# Altium project S7CAS-PLEIADES-CARTE-MERE_Pxx.PrjPcb (part 2 of 3)

## Sheet S7CAS-PLEIADES-CARTE-MERE_Pxx_FLASH_PHY_CLOCK.SchDoc
size Tabloid; SheetNumber: 10; SheetTotal: 18; Sheet_Name: FLASH CLOCK; Size: 11x17
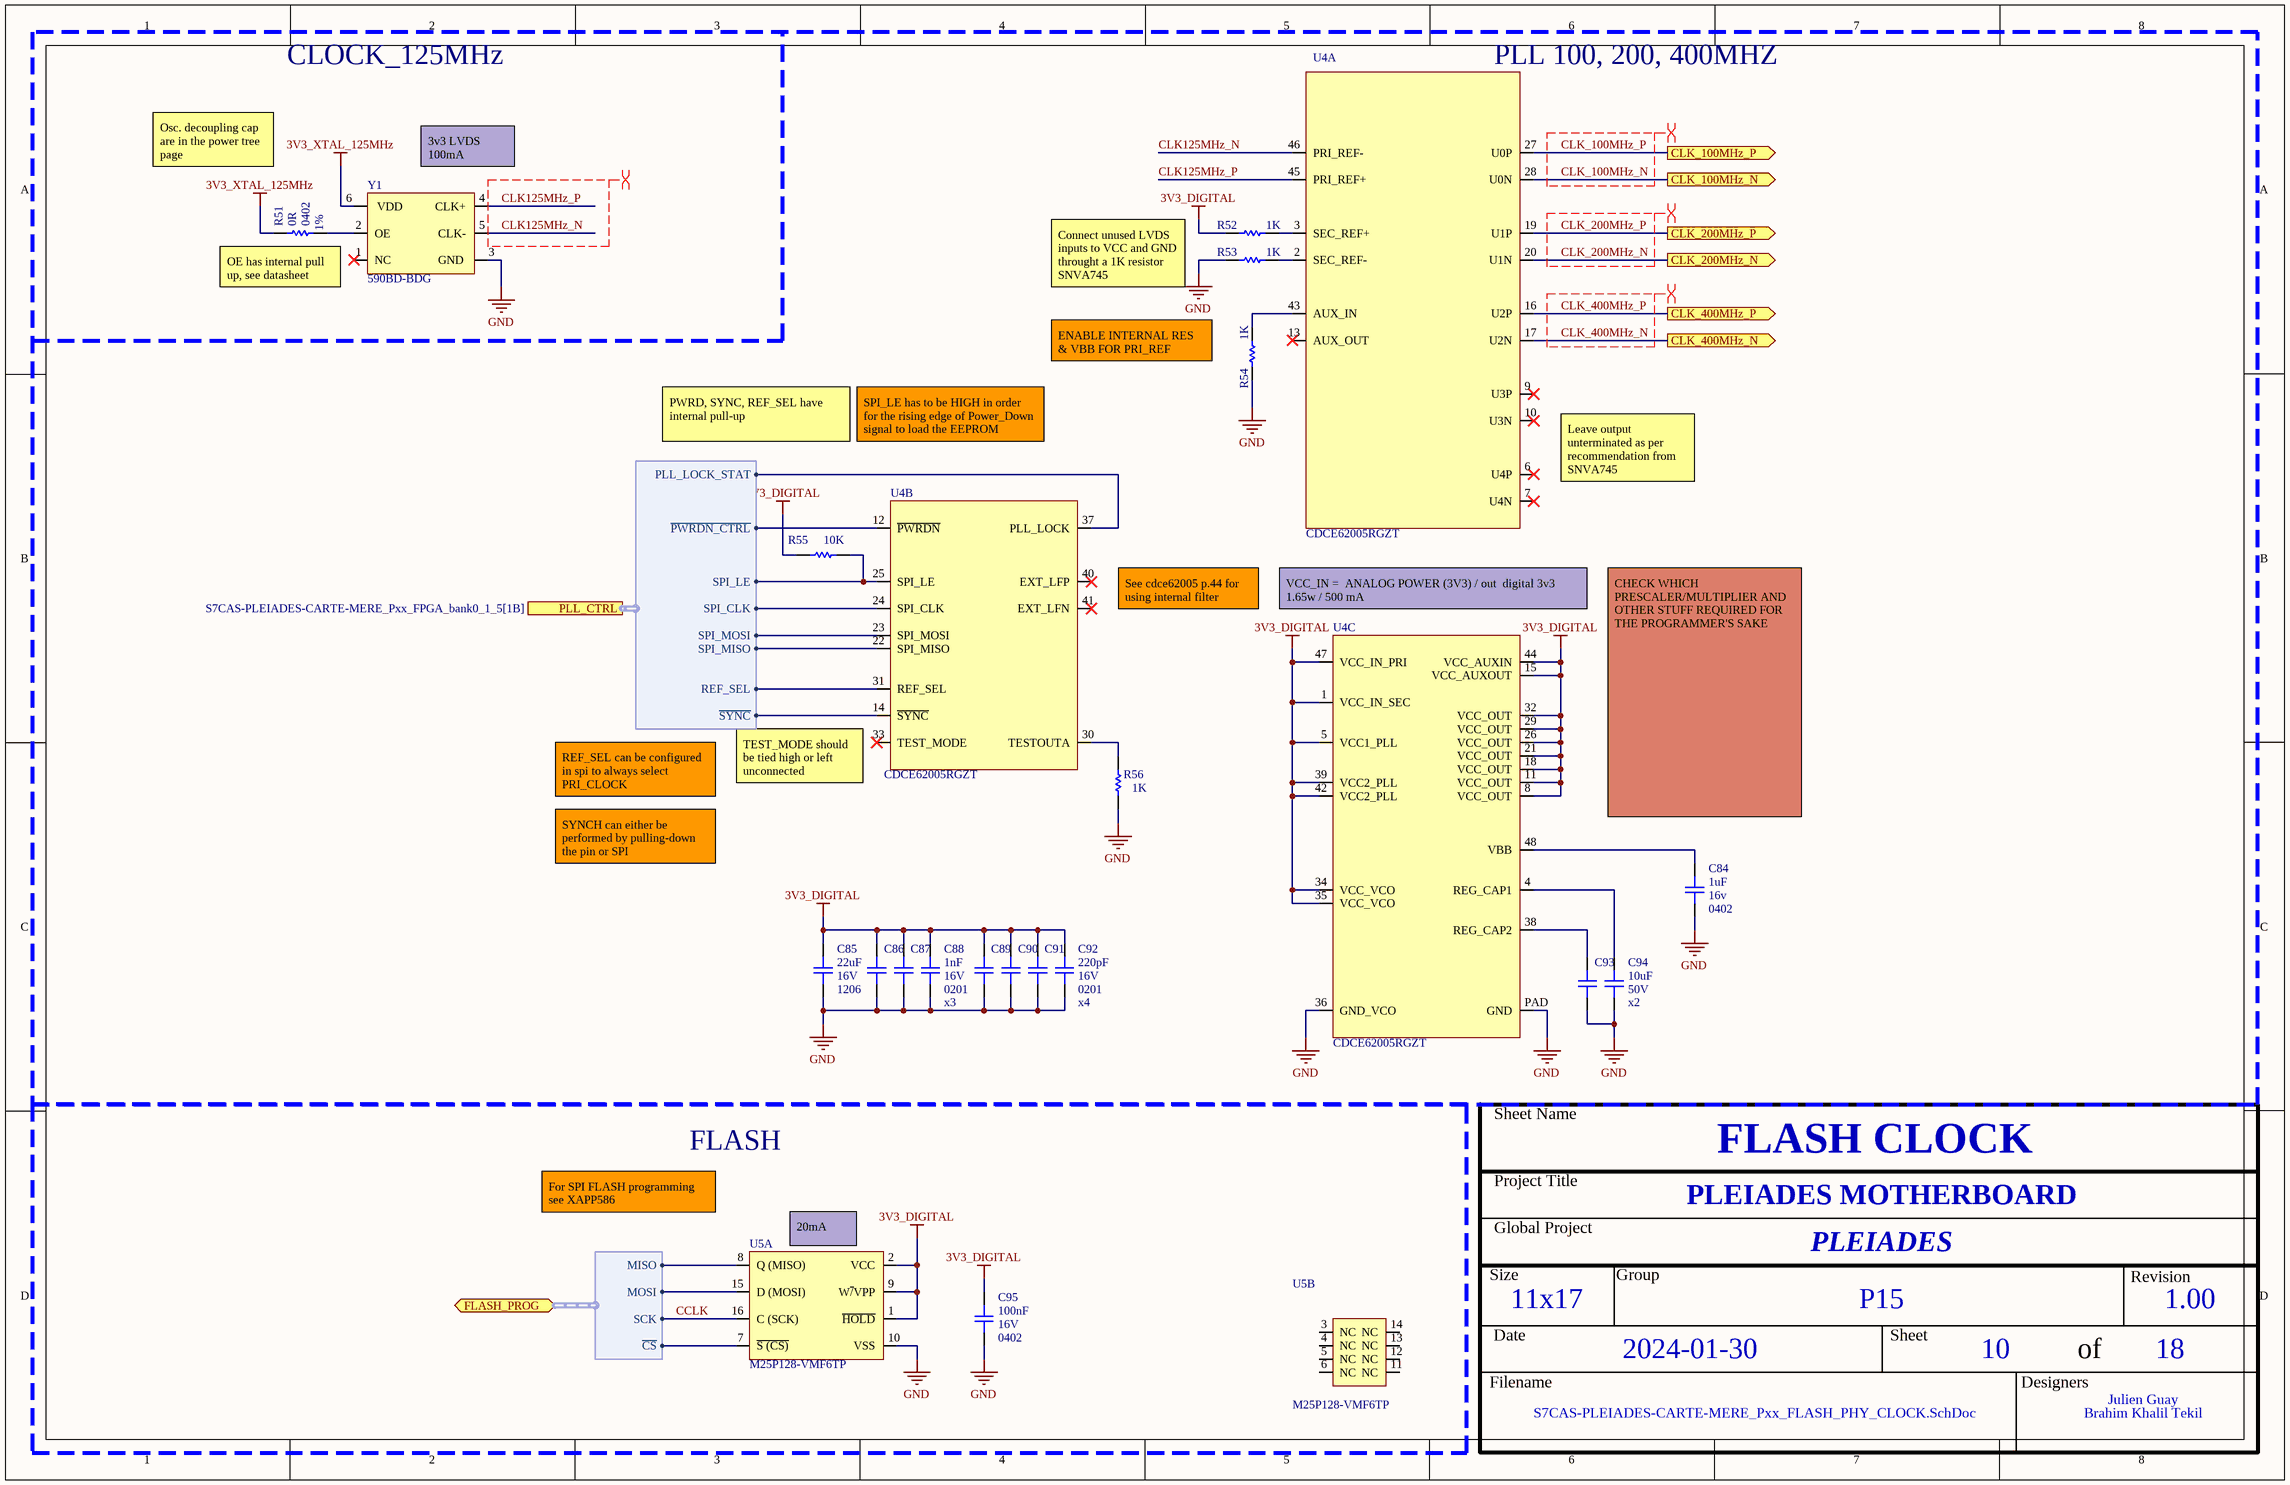
[diagram p7: S7CAS-PLEIADES-CARTE-MERE_Pxx_FLASH_PHY_CLOCK.SchDoc]

### Parts
C84  value 1uF  Voltage: 16v  [CAP_0402]  (hidden comment: 0402)
C85  value 22uF  Voltage: 16V  Package: 1206  [CAP_1206]  (hidden comment: CAP - 1206)
C86  CAP - 0201  [CAP_0201]  (value not drawn)
C87  CAP - 0201  [CAP_0201]  (value not drawn)
C88  value 1nF  Voltage: 16V  Package: 0201  [CAP_0201]  (hidden comment: CAP - 0201)
C89  CAP - 0201  [CAP_0201]  (value not drawn)
C90  CAP - 0201  [CAP_0201]  (value not drawn)
C91  CAP - 0201  [CAP_0201]  (value not drawn)
C92  value 220pF  Voltage: 16V  Package: 0201  [CAP_0201]  (hidden comment: CAP - 0201)
C93  CAP - 1206  [CAP_1206]  (value not drawn)
C94  value 10uF  Voltage: 50V  [CAP_1206]  (hidden comment: CAP - 1206)
C95  value 100nF  Voltage: 16V  [CAP_0402]  (hidden comment: 0402)
R51  value 0R  Package: 0402  Precision: 1%  [RES_0402]  (hidden comment: RES - 0603)
R52  value 1K  [RES_0402]  (hidden comment: RES - 0603)
R53  value 1K  [RES_0402]  (hidden comment: RES - 0603)
R54  value 1K  [RES_0402]  (hidden comment: RES - 0603)
R55  value 10K  [RES_0402]  (hidden comment: RES - 0603)
R56  value 1K  [RES_0402]  (hidden comment: RES - 0603)
U4  CDCE62005RGZT  [TIM_CDCE62005RGZT]  (parts A,B,C of 3)
U5  M25P128-VMF6TP  [FLASH - M25P128-VMF6TP]  (parts A,B of 2)
Y1  590BD-BDG  [OSC_590BD-BDG]

### Blocks framed on the sheet
FLASH: C95 U5

### Ports
CLK_100MHz_N (out, see S7CAS-PLEIADES-CARTE-MERE_Pxx_FPGA_bank0_1_5[4A]), CLK_100MHz_P (out, see S7CAS-PLEIADES-CARTE-MERE_Pxx_FPGA_bank0_1_5[4A]), CLK_200MHz_N (out, see S7CAS-PLEIADES-CARTE-MERE_Pxx_CAN[1C]), CLK_200MHz_P (out, see S7CAS-PLEIADES-CARTE-MERE_Pxx_CAN[1C]), CLK_400MHz_N (out, see S7CAS-PLEIADES-CARTE-MERE_Pxx_CNA[2C]), CLK_400MHz_P (out, see S7CAS-PLEIADES-CARTE-MERE_Pxx_CNA[2C]), FLASH_PROG (bidir, harness FLASH_PROG, see S7CAS-PLEIADES-CARTE-MERE_Pxx_FPGA_bank2_4[2D]), PLL_CTRL (harness PLL_CTRL, see S7CAS-PLEIADES-CARTE-MERE_Pxx_FPGA_bank0_1_5[1B])

### Harnesses
PLL_CTRL: ~{PWRDN_CTRL}, SPI_LE, SPI_CLK, SPI_MOSI, SPI_MISO, REF_SEL, ~{SYNC}, PLL_LOCK_STAT
FLASH_PROG: MISO, MOSI, SCK, ~{CS}

### Nets
3V3_DIGITAL: C85.2 C86.2 C87.2 C88.2 C89.2 C90.2 C91.2 C92.2 C95.2 R52.2 R55.2 U4.1(VCC_IN_SEC) U4.5(VCC1_PLL) U4.8(VCC_OUT) U4.11(VCC_OUT) U4.15(VCC_AUXOUT) U4.18(VCC_OUT) U4.21(VCC_OUT) U4.26(VCC_OUT) U4.29(VCC_OUT) U4.32(VCC_OUT) U4.34(VCC_VCO) U4.35(VCC_VCO) U4.39(VCC2_PLL) U4.42(VCC2_PLL) U4.44(VCC_AUXIN) U4.47(VCC_IN_PRI) U5.1(~{HOLD}) U5.2(VCC) U5.9(W~{/}VPP)
3V3_XTAL_125MHz: R51.2 Y1.6(VDD)
GND: C84.1 C85.1 C86.1 C87.1 C88.1 C89.1 C90.1 C91.1 C92.1 C93.1 C94.1 C95.1 R53.2 R54.2 R56.1 U4.36(GND_VCO) U4.PAD(GND) U5.10(VSS) Y1.3(GND)
~{PLL_PWRD_CTRL}: U4.12(~{PWRDN}) ; port PLL_CTRL.~{PWRDN_CTRL}
~{PLL_SYNC}: U4.14(~{SYNC}) ; port PLL_CTRL.~{SYNC}
CCLK: U5.16(C_(SCK)) ; port FLASH_PROG.SCK
CLK125MHz_N: U4.46(PRI_REF-) Y1.5(CLK-)
CLK125MHz_P: U4.45(PRI_REF+) Y1.4(CLK+)
CLK_100MHz_N: U4.28(U0N) ; port CLK_100MHz_N
CLK_100MHz_P: U4.27(U0P) ; port CLK_100MHz_P
CLK_200MHz_N: U4.20(U1N) ; port CLK_200MHz_N
CLK_200MHz_P: U4.19(U1P) ; port CLK_200MHz_P
CLK_400MHz_N: U4.17(U2N) ; port CLK_400MHz_N
CLK_400MHz_P: U4.16(U2P) ; port CLK_400MHz_P
PLL_CLK: U4.24(SPI_CLK) ; port PLL_CTRL.SPI_CLK
PLL_LE: R55.1 U4.25(SPI_LE) ; port PLL_CTRL.SPI_LE
PLL_LOCK_STAT: U4.37(PLL_LOCK) ; port PLL_CTRL.PLL_LOCK_STAT
PLL_MISO: U4.22(SPI_MISO) ; port PLL_CTRL.SPI_MISO
PLL_MOSI: U4.23(SPI_MOSI) ; port PLL_CTRL.SPI_MOSI
PLL_REF_SEL: U4.31(REF_SEL) ; port PLL_CTRL.REF_SEL
NetC84_2: C84.2 U4.48(VBB)
NetC93_2: C93.2 U4.38(REG_CAP2)
NetC94_2: C94.2 U4.4(REG_CAP1)
NetR51_1: R51.1 Y1.2(OE)
NetR52_1: R52.1 U4.3(SEC_REF+)
NetR53_1: R53.1 U4.2(SEC_REF-)
NetR54_1: R54.1 U4.43(AUX_IN)
NetR56_2: R56.2 U4.30(TESTOUTA)
NetU5_7: U5.7(~{S_(CS)}) ; port FLASH_PROG.~{CS}
NetU5_8: U5.8(Q_(MISO)) ; port FLASH_PROG.MISO
NetU5_15: U5.15(D_(MOSI)) ; port FLASH_PROG.MOSI

Not connected (* = marked no-connect by the designer): U4 6(U4P)* 7(U4N)* 9(U3P)* 10(U3N)* 13(AUX_OUT)* 33(TEST_MODE)* 40(EXT_LFP)* 41(EXT_LFN)*; U5 3(NC) 4(NC) 5(NC) 6(NC) 11(NC) 12(NC) 13(NC) 14(NC); Y1 1(NC)*

### Layout directives
differential pair; differential pair class XTAL_CLK_125MHz; differential pair class LVDS: CLK125MHz_N, CLK125MHz_P
differential pair; differential pair class CLK_100MHz; differential pair class LVDS: CLK_100MHz_N, CLK_100MHz_P
differential pair; differential pair class CLK_200MHz; differential pair class LVDS: CLK_200MHz_N, CLK_200MHz_P
differential pair; differential pair class CLK_400MHz; differential pair class LVDS: CLK_400MHz_N, CLK_400MHz_P

### Notes on the sheet
- CLOCK_125MHz
- PLL 100, 200, 400MHZ
- Osc. decoupling cap are in the power tree page
- (near Y1) 3v3 LVDS 100mA
- (near R51) OE has internal pull up, see datasheet
- Connect unused LVDS inputs to VCC and GND throught a 1K resistor
  SNVA745
- (near R54) ENABLE INTERNAL RES & VBB FOR PRI_REF
- PWRD, SYNC, REF_SEL have internal pull-up
- SPI_LE has to be HIGH in order for the rising edge of Power_Down signal to load the EEPROM
- (near U4) Leave output unterminated as per recommendation from SNVA745
- (near U4) See cdce62005 p.44 for using internal filter
- VCC_IN =  ANALOG POWER (3V3) / out  digital 3v3
  1.65w / 500 mA
- REF_SEL can be configured in spi to always select PRI_CLOCK
- (near U4) TEST_MODE should be tied high or left unconnected
- CHECK WHICH PRESCALER/MULTIPLIER AND OTHER STUFF REQUIRED FOR THE PROGRAMMER'S SAKE
- SYNCH can either be performed by pulling-down the pin or SPI
- x3
- (near C92) x4
- (near C94) x2
- For SPI FLASH programming see XAPP586
- (near U5) 20mA
- Sheet Name
- Project Title
- Global Project
- Size
- Group
- Revision
- Date
- Sheet
- of
- Filename
- Designers

### Library data of the parts
C84 C95 = CAP - 0603: CAP - 0402; Precision: 10%; Current: *; CreatedBy: Jonathan Bouchard; Power: *; Package: 0402; Supplier 1: Arrow Electronics
  C84: Supplier Part Number 1: CL10B105MO8NNWC
  C95: Supplier Part Number 1: CL10B104KO8NNNC
C85 C94 = CAP - 1206: Precision: 10%; Current: *; CreatedBy: Jonathan Bouchard; Power: *
  C85: Supplier 1: Arrow Electronics; Supplier Part Number 1: CL31A226MOCLNNC
  C94: Package: 1206; Supplier 1: Avnet; Supplier Part Number 1: CL31A106MBHNNNE
C86 C87 = CAP - 0201: Precision: 10%; Voltage: 16V; Value: 1nF; Current: *; CreatedBy: Jonathan Bouchard; Power: *; Package: 0201; Supplier 1: Avnet; Supplier Part Number 1: GRM033R71C102KA01J
C88 C92 = CAP - 0201: Precision: 10%; Current: *; CreatedBy: Jonathan Bouchard; Power: *
  C88: Supplier 1: Avnet; Supplier Part Number 1: GRM033R71C102KA01J
  C92: Supplier 1: Arrow Electronics; Supplier Part Number 1: GRM033R71C221KA01D
C89-C91 = CAP - 0201: Precision: 10%; Voltage: 16V; Value: 220pF; Current: *; CreatedBy: Jonathan Bouchard; Power: *; Package: 0201; Supplier 1: Arrow Electronics; Supplier Part Number 1: GRM033R71C221KA01D
C93 = CAP - 1206: Precision: 10%; Voltage: 50V; Value: 10uF; Current: *; CreatedBy: Jonathan Bouchard; Power: *; Package: 1206; Supplier 1: Avnet; Supplier Part Number 1: CL31A106MBHNNNE
R51 = RES - 0603: RES - 0402; Current: *; CreatedBy: Jonathan Bouchard; Supplier 1: Arrow Electronics; Supplier Part Number 1: RMCF0603ZT0R00
R52-R56 = RES - 0603: RES - 0402; Precision: 1%; Current: *; CreatedBy: Jonathan Bouchard; Package: 0402
  R52-R54: Supplier 1: Mouser; Supplier Part Number 1: 71-CRCW0603-10K-E3
  R55: Supplier 1: Arrow Electronics; Supplier Part Number 1: RMCF0603FT10K0
  R56: Supplier 1: Arrow Electronics; Supplier Part Number 1: RMCF0603FT1K00
U4 = TIM_CDCE62005RGZT: TIM - CLK SYNTH JITTER CLEANER 3:5 - QFN-48; Voltage: 3 V ~ 3.6 V; Mfg: Texas Instruments; Current: *; Power: *; Mfg Part Number: CDCE62005RGZT; HelpURL: http://www.ti.com/lit/ds/symlink/cdce62005.pdf; CreatedBy: Jonathan Bouchard; Temperature: -40°C ~ 85°C; Value: *; Precision: *; Package: QFN-48; Supplier 1: Digikey; Supplier Part Number 1: 296-23947-1-ND
U5 = FLASH  - M25P128-VMF6TP: 128-Mbit, low-voltage, serial flash memory / with 54-MHz SPI bus interface; GRAMS Lib Spec: 2.7; Supplier 1: Digikey; Supplier Part Number 1: M25P128-VMF6TP CT-ND
Y1 = OSC_590BD-BDG: TIM - OSC PROG 125MHz ~ 214.999MHz LVDS 3.3V 7PPM EN/DS - 6-SMD; Manufacturer #1: Silicon Labs; Current Rating: 100 mA (supply); Note: Spécifié la fréquence lors de la commande; Voltage rating: 3.3V (supply); Polarized: Yes; Value: ±7ppm (freq Stability), ±20ppm (freq stability total); Magnetic Material: UNKNOWN; GRAMS Lib Spec: 2.8; Manufacturer #2: *; Power Max: *; Part Number #1: 590BD-BDG; Part Number #2: *; HelpURL: https://www.silabs.com/documents/public/data-sheets/Si590-591.pdf; Supplier 1: Digi-Key; Supplier Part Number 1: 590BD-BDG-ND; Assembly Type: SMD; Temperature: -40°C ~ 85°C; Package: 6-SMD; CreatedBy/Date: from 590BD-CDG; Tolerance: *; VerifiedBy: Caroline Paulin / 3/10/2019; Cryo: UNKNOWN

## Sheet S7CAS-PLEIADES-CARTE-MERE_Pxx_CAN.SchDoc
size Tabloid; SheetNumber: 12; SheetTotal: 18; Sheet_Name: CAN; Size: 11x17
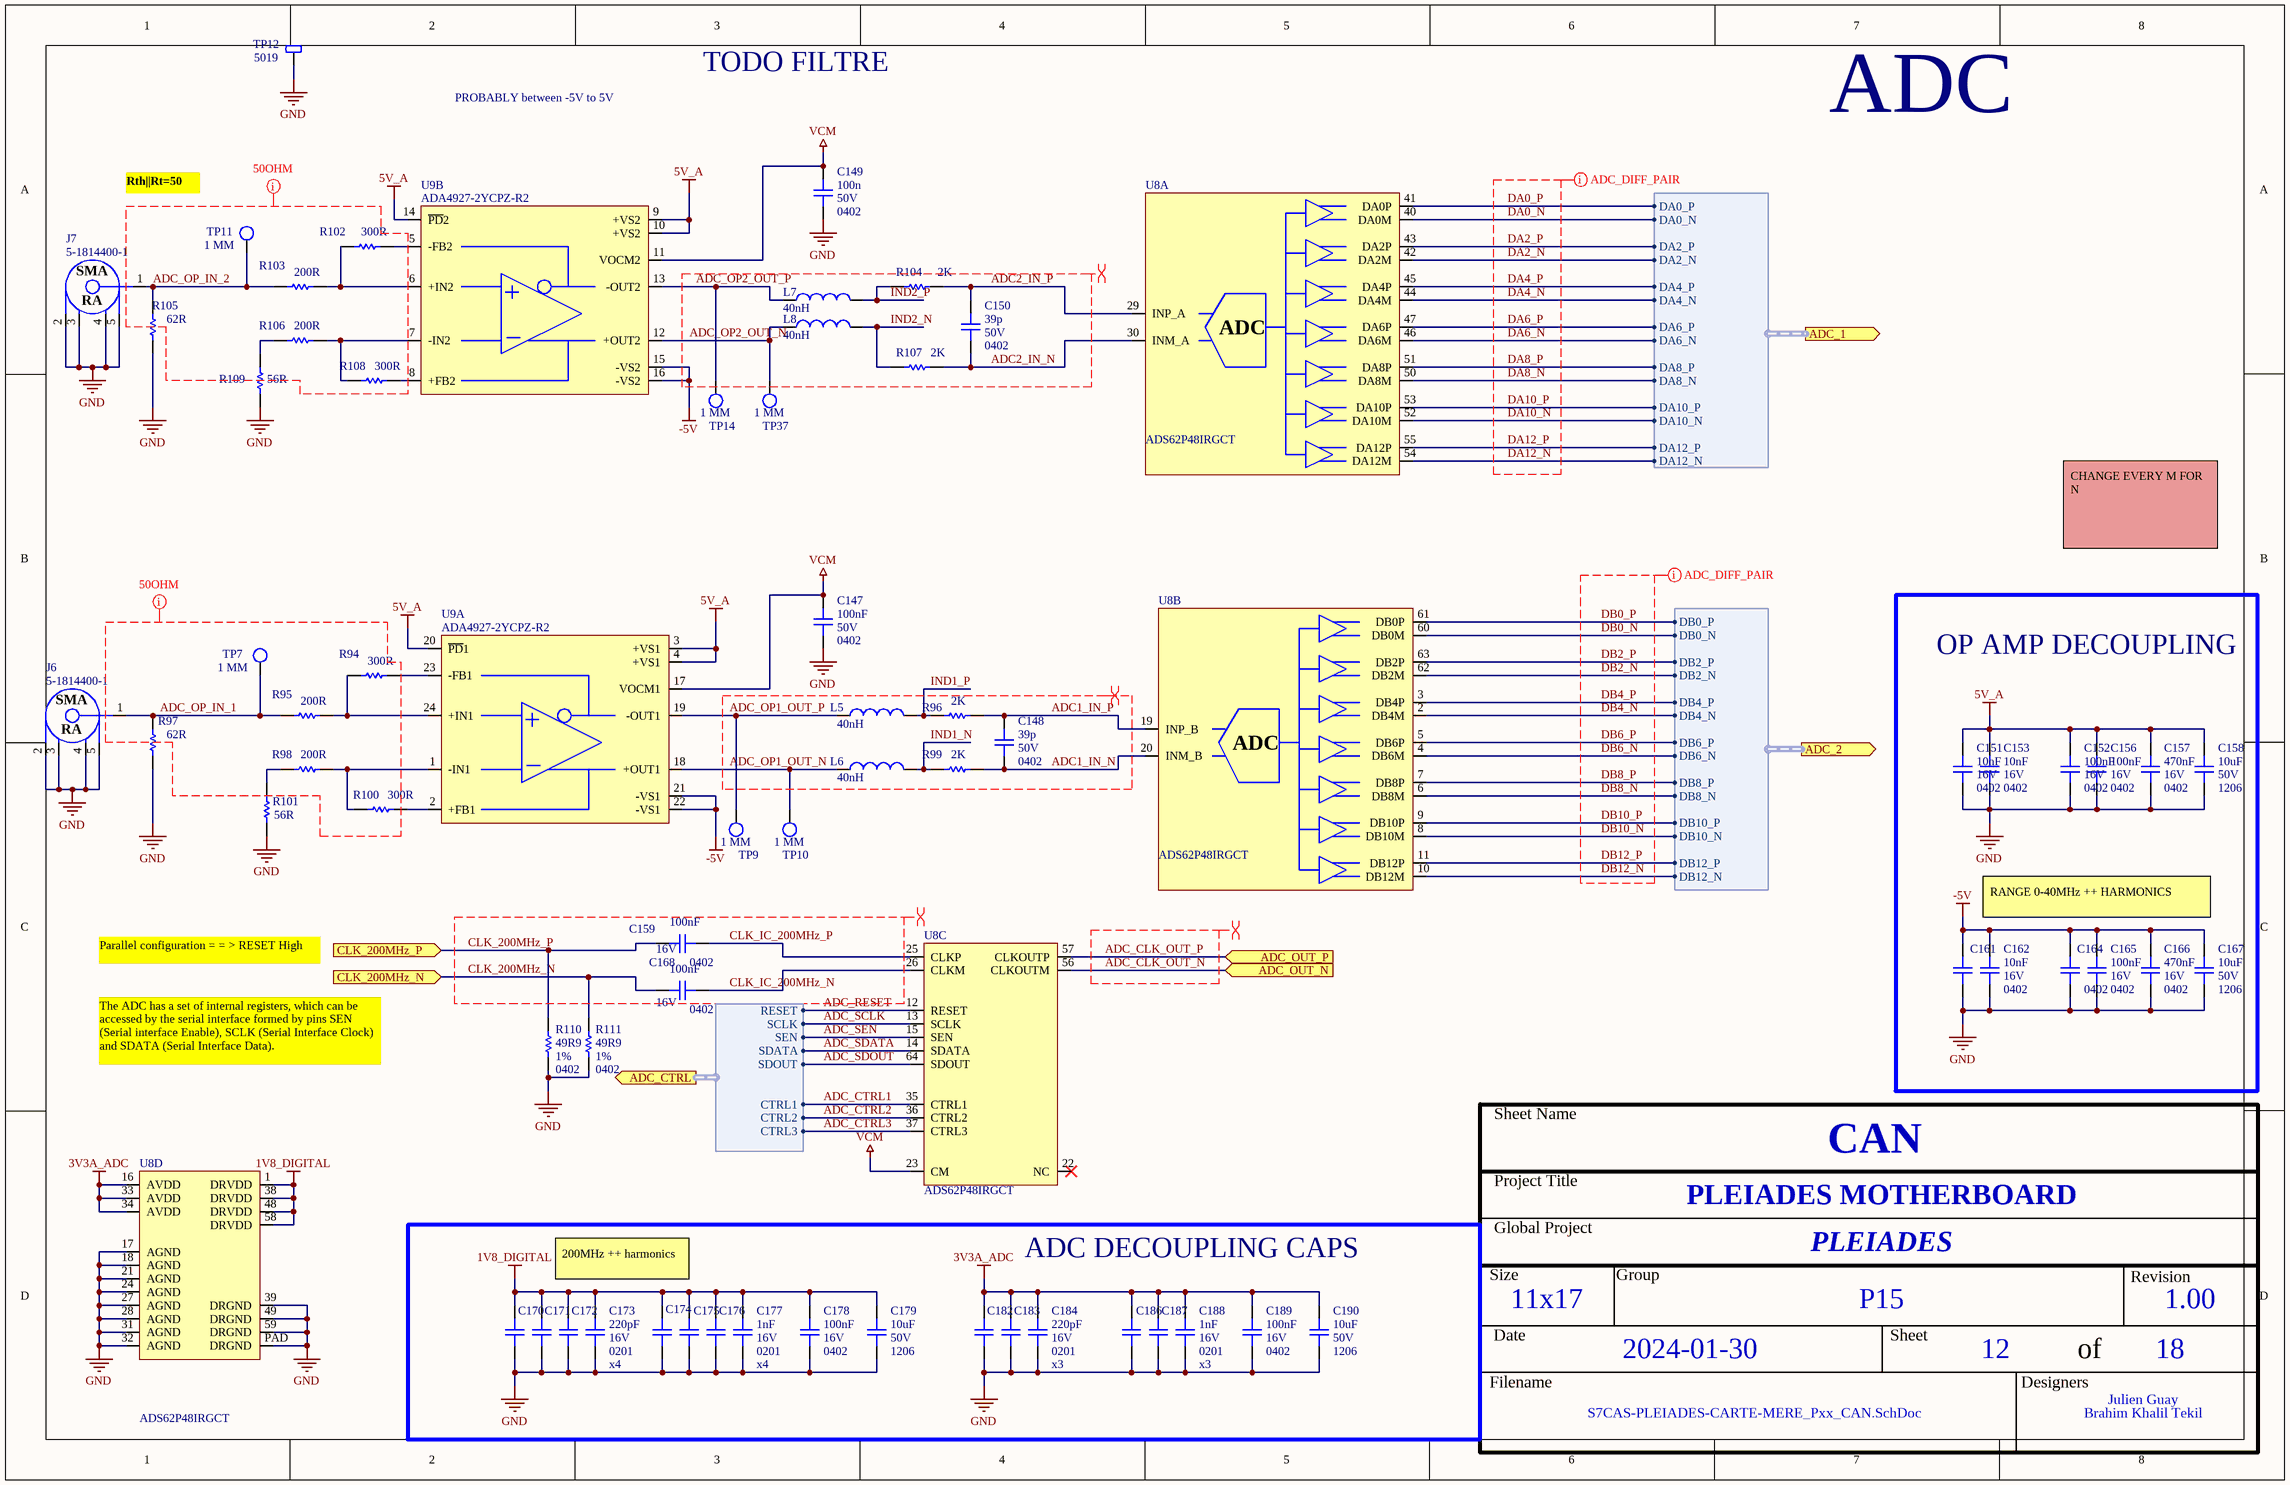
[diagram p8: S7CAS-PLEIADES-CARTE-MERE_Pxx_CAN.SchDoc]

### Parts
C147  value 100nF  Voltage: 50V  [CAP_0402]  (hidden comment: 0402)
C148  value 39p  Voltage: 50V  [CAP_0402]  (hidden comment: 0402)
C149  value 100n  Voltage: 50V  [CAP_0402]  (hidden comment: 0402)
C150  value 39p  Voltage: 50V  [CAP_0402]  (hidden comment: 0402)
C151  value 10nF  Voltage: 16V  Package: 0402  [CAP_0402]  (hidden comment: CAP - 0402)
C152  value 100nF  Voltage: 16V  [CAP_0402]  (hidden comment: 0402)
C153  value 10nF  Voltage: 16V  Package: 0402  [CAP_0402]  (hidden comment: CAP - 0402)
C156  value 100nF  Voltage: 16V  [CAP_0402]  (hidden comment: 0402)
C157  value 470nF  Voltage: 16V  [CAP_0402]  (hidden comment: 0402)
C158  value 10uF  Voltage: 50V  Package: 1206  [CAP_1206]  (hidden comment: CAP - 1206)
C159  value 100nF  Voltage: 16V  [CAP_0402]  (hidden comment: 0402)
C161  CAP - 0402  [CAP_0402]  (value not drawn)
C162  value 10nF  Voltage: 16V  Package: 0402  [CAP_0402]  (hidden comment: CAP - 0402)
C164  0402  [CAP_0402]
C165  value 100nF  Voltage: 16V  [CAP_0402]  (hidden comment: 0402)
C166  value 470nF  Voltage: 16V  [CAP_0402]  (hidden comment: 0402)
C167  value 10uF  Voltage: 50V  Package: 1206  [CAP_1206]  (hidden comment: CAP - 1206)
C168  value 100nF  Voltage: 16V  [CAP_0402]  (hidden comment: 0402)
C170  CAP - 0201  [CAP_0201]  (value not drawn)
C171  CAP - 0201  [CAP_0201]  (value not drawn)
C172  CAP - 0201  [CAP_0201]  (value not drawn)
C173  value 220pF  Voltage: 16V  Package: 0201  [CAP_0201]  (hidden comment: CAP - 0201)
C174  CAP - 0201  [CAP_0201]  (value not drawn)
C175  CAP - 0201  [CAP_0201]  (value not drawn)
C176  CAP - 0201  [CAP_0201]  (value not drawn)
C177  value 1nF  Voltage: 16V  Package: 0201  [CAP_0201]  (hidden comment: CAP - 0201)
C178  value 100nF  Voltage: 16V  [CAP_0402]  (hidden comment: 0402)
C179  value 10uF  Voltage: 50V  Package: 1206  [CAP_1206]  (hidden comment: CAP - 1206)
C182  CAP - 0201  [CAP_0201]  (value not drawn)
C183  CAP - 0201  [CAP_0201]  (value not drawn)
C184  value 220pF  Voltage: 16V  Package: 0201  [CAP_0201]  (hidden comment: CAP - 0201)
C186  CAP - 0201  [CAP_0201]  (value not drawn)
C187  CAP - 0201  [CAP_0201]  (value not drawn)
C188  value 1nF  Voltage: 16V  Package: 0201  [CAP_0201]  (hidden comment: CAP - 0201)
C189  value 100nF  Voltage: 16V  [CAP_0402]  (hidden comment: 0402)
C190  value 10uF  Voltage: 50V  Package: 1206  [CAP_1206]  (hidden comment: CAP - 1206)
J6  5-1814400-1  [CONN_SMA_5-1814400-1]
J7  5-1814400-1  [CONN_SMA_5-1814400-1]
L5  value 40nH  [IND - 0402]  (hidden comment: INDUCTOR - 0402)
L6  value 40nH  [IND - 0402]  (hidden comment: INDUCTOR - 0402)
L7  value 40nH  [IND - 0402]  (hidden comment: INDUCTOR - 0402)
L8  value 40nH  [IND - 0402]  (hidden comment: INDUCTOR - 0402)
R94  value 300R  [RES_0402]  (hidden comment: RES - 0603)
R95  value 200R  [RES_0402]  (hidden comment: RES - 0603)
R96  value 2K  [RES_0402]  (hidden comment: RES - 0603)
R97  value 62R  [RES_0402]  (hidden comment: RES - 0603)
R98  value 200R  [RES_0402]  (hidden comment: RES - 0603)
R99  value 2K  [RES_0402]  (hidden comment: RES - 0603)
R100  value 300R  [RES_0402]  (hidden comment: RES - 0603)
R101  value 56R  [RES_0402]  (hidden comment: RES - 0603)
R102  value 300R  [RES_0402]  (hidden comment: RES - 0603)
R103  value 200R  [RES_0402]  (hidden comment: RES - 0603)
R104  value 2K  [RES_0402]  (hidden comment: RES - 0603)
R105  value 62R  [RES_0402]  (hidden comment: RES - 0603)
R106  value 200R  [RES_0402]  (hidden comment: RES - 0603)
R107  value 2K  [RES_0402]  (hidden comment: RES - 0603)
R108  value 300R  [RES_0402]  (hidden comment: RES - 0603)
R109  value 56R  [RES_0402]  (hidden comment: RES - 0603)
R110  value 49R9  Package: 0402  Precision: 1%  [RES_0402]  (hidden comment: RES - 0603)
R111  value 49R9  Package: 0402  Precision: 1%  [RES_0402]  (hidden comment: RES - 0603)
TP7  1 MM  [TPO_SMD_ROUND_1MM]  (no BOM)
TP9  1 MM  [TPO_SMD_ROUND_1MM]  (no BOM)
TP10  1 MM  [TPO_SMD_ROUND_1MM]  (no BOM)
TP11  1 MM  [TPO_SMD_ROUND_1MM]  (no BOM)
TP12  5019  [TPO_SMD_5019]
TP14  1 MM  [TPO_SMD_ROUND_1MM]  (no BOM)
TP37  1 MM  [TPO_SMD_ROUND_1MM]  (no BOM)
U8  ADS62P48IRGCT  [ADC_ADS62P48IRGCT]  (parts A,B,C,D of 4)
U9  ADA4927-2YCPZ-R2  [OPAMP_ADA4927-2YCPZ-R2]  (parts A,B of 2)

### Blocks framed on the sheet
OP AMP DECOUPLING: C151-C153 C156-C158 C161 C162 C164-C167
ADC DECOUPLING CAPS: C170-C179 C182-C184 C186-C190

### Ports
ADC_1 (out, harness ADC_1_HARNESS, see S7CAS-PLEIADES-CARTE-MERE_Pxx_FPGA_bank3[1A]), ADC_2 (out, harness ADC_2_HARNESS, see S7CAS-PLEIADES-CARTE-MERE_Pxx_FPGA_bank3[1B]), ADC_CTRL (out, harness ADC_CTRL_HARNESS, see S7CAS-PLEIADES-CARTE-MERE_Pxx_FPGA_bank3[2C]), ADC_OUT_N (in, see S7CAS-PLEIADES-CARTE-MERE_Pxx_FPGA_bank3[5B]), ADC_OUT_P (in, see S7CAS-PLEIADES-CARTE-MERE_Pxx_FPGA_bank3[5B]), CLK_200MHz_N (in, see S7CAS-PLEIADES-CARTE-MERE_Pxx_FLASH_PHY_CLOCK[5A]), CLK_200MHz_P (in, see S7CAS-PLEIADES-CARTE-MERE_Pxx_FLASH_PHY_CLOCK[5A])

### Harnesses
ADC_1_HARNESS: DA0_P, DA0_N, DA2_P, DA2_N, DA4_P, DA4_N, DA6_P, DA6_N, DA8_P, DA8_N, DA10_P, DA10_N, DA12_P, DA12_N
ADC_2_HARNESS: DB0_P, DB0_N, DB2_P, DB2_N, DB4_P, DB4_N, DB6_P, DB6_N, DB8_P, DB8_N, DB10_P, DB10_N, DB12_P, DB12_N
ADC_CTRL_HARNESS: RESET, SCLK, SEN, SDATA, SDOUT, CTRL1, CTRL2, CTRL3

### Nets
1V8_DIGITAL: C170.2 C171.2 C172.2 C173.2 C174.2 C175.2 C176.2 C177.2 C178.2 C179.2 U8.1(DRVDD) U8.38(DRVDD) U8.48(DRVDD) U8.58(DRVDD)
3V3A_ADC: C182.2 C183.2 C184.2 C186.2 C187.2 C188.2 C189.2 C190.2 U8.16(AVDD) U8.33(AVDD) U8.34(AVDD)
5V_A: C151.2 C152.2 C153.2 C156.2 C157.2 C158.2 U9.3(+VS1) U9.4(+VS1) U9.9(+VS2) U9.10(+VS2) U9.14(~{PD}2) U9.20(~{PD}1)
-5V: C161.2 C162.2 C164.2 C165.2 C166.2 C167.2 U9.15(-VS2) U9.16(-VS2) U9.21(-VS1) U9.22(-VS1)
GND: C147.1 C149.1 C151.1 C152.1 C153.1 C156.1 C157.1 C158.1 C161.1 C162.1 C164.1 C165.1 C166.1 C167.1 C170.1 C171.1 C172.1 C173.1 C174.1 C175.1 C176.1 C177.1 C178.1 C179.1 C182.1 C183.1 C184.1 C186.1 C187.1 C188.1 C189.1 C190.1 J6.2 J6.3 J6.4 J6.5 J7.2 J7.3 J7.4 J7.5 R97.1 R101.2 R105.1 R109.2 R110.1 R111.1 TP12.1 U8.17(AGND) U8.18(AGND) U8.21(AGND) U8.24(AGND) U8.27(AGND) U8.28(AGND) U8.31(AGND) U8.32(AGND) U8.39(DRGND) U8.49(DRGND) U8.59(DRGND) U8.PAD(DRGND)
VCM: C147.2 C149.2 U8.23(CM) U9.11(VOCM2) U9.17(VOCM1)
ADC1_IN_N: C148.1 R99.1 U8.20(INM_B)
ADC1_IN_P: C148.2 R96.1 U8.19(INP_B)
ADC2_IN_N: C150.1 R107.1 U8.30(INM_A)
ADC2_IN_P: C150.2 R104.1 U8.29(INP_A)
ADC_CLK_OUT_N: U8.56(CLKOUTM) ; port ADC_OUT_N
ADC_CLK_OUT_P: U8.57(CLKOUTP) ; port ADC_OUT_P
ADC_CTRL1: U8.35(CTRL1) ; port ADC_CTRL.CTRL1
ADC_CTRL2: U8.36(CTRL2) ; port ADC_CTRL.CTRL2
ADC_CTRL3: U8.37(CTRL3) ; port ADC_CTRL.CTRL3
ADC_OP1_OUT_N: L6.1 TP10.1 U9.18(+OUT1)
ADC_OP1_OUT_P: L5.1 TP9.1 U9.19(-OUT1)
ADC_OP2_OUT_N: L8.1 TP37.1 U9.12(+OUT2)
ADC_OP2_OUT_P: L7.1 TP14.1 U9.13(-OUT2)
ADC_OP_IN_1: J6.1 R95.2 R97.2 TP7.1
ADC_OP_IN_2: J7.1 R103.2 R105.2 TP11.1
ADC_RESET: U8.12(RESET) ; port ADC_CTRL.RESET
ADC_SCLK: U8.13(SCLK) ; port ADC_CTRL.SCLK
ADC_SDATA: U8.14(SDATA) ; port ADC_CTRL.SDATA
ADC_SDOUT: U8.64(SDOUT) ; port ADC_CTRL.SDOUT
ADC_SEN: U8.15(SEN) ; port ADC_CTRL.SEN
CLK_200MHz_N: C168.2 R111.2 ; port CLK_200MHz_N
CLK_200MHz_P: C159.2 R110.2 ; port CLK_200MHz_P
CLK_IC_200MHz_N: C168.1 U8.26(CLKM)
CLK_IC_200MHz_P: C159.1 U8.25(CLKP)
DA0_N: U8.40(DA0M) ; port ADC_1.DA0_N
DA0_P: U8.41(DA0P) ; port ADC_1.DA0_P
DA2_N: U8.42(DA2M) ; port ADC_1.DA2_N
DA2_P: U8.43(DA2P) ; port ADC_1.DA2_P
DA4_N: U8.44(DA4M) ; port ADC_1.DA4_N
DA4_P: U8.45(DA4P) ; port ADC_1.DA4_P
DA6_N: U8.46(DA6M) ; port ADC_1.DA6_N
DA6_P: U8.47(DA6P) ; port ADC_1.DA6_P
DA8_N: U8.50(DA8M) ; port ADC_1.DA8_N
DA8_P: U8.51(DA8P) ; port ADC_1.DA8_P
DA10_N: U8.52(DA10M) ; port ADC_1.DA10_N
DA10_P: U8.53(DA10P) ; port ADC_1.DA10_P
DA12_N: U8.54(DA12M) ; port ADC_1.DA12_N
DA12_P: U8.55(DA12P) ; port ADC_1.DA12_P
DB0_N: U8.60(DB0M) ; port ADC_2.DB0_N
DB0_P: U8.61(DB0P) ; port ADC_2.DB0_P
DB2_N: U8.62(DB2M) ; port ADC_2.DB2_N
DB2_P: U8.63(DB2P) ; port ADC_2.DB2_P
DB4_N: U8.2(DB4M) ; port ADC_2.DB4_N
DB4_P: U8.3(DB4P) ; port ADC_2.DB4_P
DB6_N: U8.4(DB6M) ; port ADC_2.DB6_N
DB6_P: U8.5(DB6P) ; port ADC_2.DB6_P
DB8_N: U8.6(DB8M) ; port ADC_2.DB8_N
DB8_P: U8.7(DB8P) ; port ADC_2.DB8_P
DB10_N: U8.8(DB10M) ; port ADC_2.DB10_N
DB10_P: U8.9(DB10P) ; port ADC_2.DB10_P
DB12_N: U8.10(DB12M) ; port ADC_2.DB12_N
DB12_P: U8.11(DB12P) ; port ADC_2.DB12_P
IND1_N: L6.2 R99.2
IND1_P: L5.2 R96.2
IND2_N: L8.2 R107.2
IND2_P: L7.2 R104.2
NetR94_1: R94.1 U9.23(-FB1)
NetR94_2: R94.2 R95.1 U9.24(+IN1)
NetR98_1: R98.1 R100.2 U9.1(-IN1)
NetR98_2: R98.2 R101.1
NetR100_1: R100.1 U9.2(+FB1)
NetR102_1: R102.1 U9.5(-FB2)
NetR102_2: R102.2 R103.1 U9.6(+IN2)
NetR106_1: R106.1 R108.2 U9.7(-IN2)
NetR106_2: R106.2 R109.1
NetR108_1: R108.1 U9.8(+FB2)

Not connected (* = marked no-connect by the designer): U8 22(NC)*

### Layout directives
differential pair; differential pair class ADC_DATA_OUT; differential pair class LVDS: DA0_N, DA0_P, DA2_N, DA2_P, DA4_N, DA4_P, DA6_N, DA6_P, DA8_N, DA8_P, DA10_N, DA10_P, DA12_N, DA12_P, DB0_N, DB0_P, DB2_N, DB2_P, DB4_N, DB4_P, DB6_N, DB6_P, DB8_N, DB8_P, DB10_N, DB10_P, DB12_N, DB12_P
differential pair; differential pair class CLK_200MHz; differential pair class LVDS: CLK_200MHz_N, CLK_200MHz_P, CLK_IC_200MHz_N, CLK_IC_200MHz_P
differential pair; differential pair class ADC_REF_CLOCK; differential pair class LVDS: ADC_CLK_OUT_N, ADC_CLK_OUT_P
differential pair; differential pair class OP_AMP_DIFF_CLASS; differential pair class 100OHMDIFF: ADC1_IN_N, ADC1_IN_P, ADC2_IN_N, ADC2_IN_P, ADC_OP1_OUT_N, ADC_OP1_OUT_P, ADC_OP2_OUT_N, ADC_OP2_OUT_P, IND1_N, IND2_N, IND2_P
net class 50OHM: ADC_OP_IN_1, ADC_OP_IN_2

### Notes on the sheet
- TODO FILTRE
- PROBABLY between -5V to 5V
- ADC
- Rth||Rt=50
- CHANGE EVERY M FOR N
- Parallel configuration = = > RESET High
- RANGE 0-40MHz ++ HARMONICS
- The ADC has a set of internal registers, which can be accessed by the serial interface formed by pins SEN
  (Serial interface Enable), SCLK (Serial Interface Clock) and SDATA (Serial Interface Data).
- 200MHz ++ harmonics
- (near C173) x4
- (near C177) x4
- (near C184) x3
- (near C188) x3
- Sheet Name
- Project Title
- Global Project
- Size
- Group
- Revision
- Date
- Sheet
- of
- Filename
- Designers
- (in symbol ADC_ADS62P48IRGCT, part A) ADC
- (in symbol ADC_ADS62P48IRGCT, part B) ADC
- (in symbol CONN_SMA_5-1814400-1) SMA; RA

### Library data of the parts
C147-C150 C152 C156 C157 C159 C165 C166 C168 C178 C189 = CAP - 0603: CAP - 0402; Precision: 10%; Current: *; CreatedBy: Jonathan Bouchard; Power: *; Package: 0402
  C152 C156 C159 C165 C168 C178 C189: Supplier 1: Arrow Electronics; Supplier Part Number 1: CL10B104KO8NNNC
  C157 C166: Supplier 1: Arrow Electronics; Supplier Part Number 1: C1608X7R1C474K080AC
C151 C153 C162 = CAP - 0402: Precision: 10%; Current: *; CreatedBy: Jonathan Bouchard; Power: *; Supplier 1: Arrow Electronics; Supplier Part Number 1: GRM155R61A224KE19D
C158 C167 C179 C190 = CAP - 1206: Precision: 10%; Current: *; CreatedBy: Jonathan Bouchard; Power: *; Supplier 1: Avnet; Supplier Part Number 1: CL31A106MBHNNNE
C161 = CAP - 0402: Precision: 10%; Voltage: 16V; Value: 10nF; Current: *; CreatedBy: Jonathan Bouchard; Power: *; Package: 0402; Supplier 1: Arrow Electronics; Supplier Part Number 1: GRM155R61A224KE19D
C164 = CAP - 0603: CAP - 0402; Precision: 10%; Voltage: 16V; Value: 100nF; Current: *; CreatedBy: Jonathan Bouchard; Power: *; Package: 0402; Supplier 1: Arrow Electronics; Supplier Part Number 1: CL10B104KO8NNNC
C170-C172 C182 C183 = CAP - 0201: Precision: 10%; Voltage: 16V; Value: 220pF; Current: *; CreatedBy: Jonathan Bouchard; Power: *; Package: 0201; Supplier 1: Arrow Electronics; Supplier Part Number 1: GRM033R71C221KA01D
C173 C177 C184 C188 = CAP - 0201: Precision: 10%; Current: *; CreatedBy: Jonathan Bouchard; Power: *
  C173 C184: Supplier 1: Arrow Electronics; Supplier Part Number 1: GRM033R71C221KA01D
  C177 C188: Supplier 1: Avnet; Supplier Part Number 1: GRM033R71C102KA01J
C174-C176 C186 C187 = CAP - 0201: Precision: 10%; Voltage: 16V; Value: 1nF; Current: *; CreatedBy: Jonathan Bouchard; Power: *; Package: 0201; Supplier 1: Avnet; Supplier Part Number 1: GRM033R71C102KA01J
J6 J7 = CONN_SMA_5-1814400-1: CONN -  SMA JACK R/A 50 OHM - TH; Mfg: TE Connectivity AMP Connectors; Voltage: *; Current: *; Power: *; Mfg Part Number: 5-1814400-1; HelpURL: http://www.te.com/commerce/DocumentDelivery/DDEController?Action=srchrtrv&DocNm=1814400&DocType=Customer+Drawing&DocLang=English; CreatedBy: Jonathan Bouchard; Temperature: -55°C ~ 85°C; Value: *; Precision: *; Package: TH-5; Supplier 1: Digikey; Supplier Part Number 1: A97593-ND
L5-L8 = INDUCT - 0402: GRAMS Lib Spec: 2.7; Saturation Val: [SATURATION]; Supplier 1: Mouser; Supplier Part Number 1: 81-LQW15AN40NG00D
R94-R111 = RES - 0603: RES - 0402; Current: *; CreatedBy: Jonathan Bouchard
  R110 R111: Supplier 1: Mouser; Supplier Part Number 1: 667-ERJ-3EKF49R9V
TP7 TP9-TP11 TP14 TP37 = TPO_SMD_ROUND_1MM: TPO - TEST POINT ROUND SMD PAD ONLY  - 1 MM; Magnetic Material: NO; GRAMS Lib Spec: 2.8; Cryo: UNKNOWN; Current Rating: *; Manufacturer #1: *; Manufacturer #2: *; Note: *; Power Max: *; Value: *; Part Number #2: *; HelpURL: *; Polarized: *; Supplier 1: *; Supplier Part Number 1: *; Assembly Type: NONE; Part Number #1: *; Package: 1 MM ROUND; CreatedBy/Date: Jonathan Bouchard 2018-07-17; Temperature: *; Tolerance: *; VerifiedBy: Arnaud Samson 23-07-18; Voltage Rating: *
TP12 = TPO_SMD_5019: TPO - PC TEST POINT MINI - SMD; Manufacturer #1: Keystone Electronics; Value: 3.81mm x 2.03mm; Polarized: No; Magnetic Material: UNKNOWN; GRAMS Lib Spec: 2.8; Current Rating: *; Manufacturer #2: *; Note: *; Power Max: *; Part Number #2: *; HelpURL: https://www.digikey.ca/product-detail/en/keystone-electronics/5019/36-5019CT-ND/3907344; Supplier 1: Digi-Key; Supplier Part Number 1: 36-5019CT-ND; Assembly Type: SMD; Part Number #1: 5019; Package: SMD; CreatedBy/Date: Olivier Bernard / 5/12/2017; Temperature: *; Tolerance: *; VerifiedBy: Caroline Paulin / 5 juillet 2018; Voltage Rating: *; Cryo: UNKNOWN
U8 = ADC_ADS62P48IRGCT: ADC - 14 BIT 210MSPS SUAL - VQFN-64; Voltage: 3.15 V ~ 3.6 V / 1.7 V ~ 1.9 V; Mfg: Texas Instruments; Precision: 14 Bit; Current: *; Power: *; Mfg Part Number: ADS62P48IRGCT; HelpURL: http://www.ti.com/lit/ds/symlink/ads62p48.pdf; CreatedBy: Jonathan Bouchard; Temperature: -40°C ~ 85°C; Value: *; Package: VQFN-64; Supplier 1: Mouser; Supplier Part Number 1: 595-ADS62P48IRGCT
U9 = OPAMP_ADA4927-2YCPZ-R2: OPAMP - CFA 2.3GHZ - QFN-24; Voltage: 4.5 V ~ 11 V, ±2.25 V ~ 5.5 V; Current: 65mA; Mfg: Analog Devices; Power: *; Mfg Part Number: ADA4927-2YCPZ-R2; HelpURL: http://www.analog.com/media/en/technical-documentation/data-sheets/ADA4927-1_4927-2.pdf; CreatedBy: Jonathan Bouchard; Temperature: -40°C ~ 105°C; Value: *; Precision: *; Package: QFN-24; Supplier 1: Digikey; Supplier Part Number 1: ADA4927-2YCPZ-R2CT-ND

## Sheet S7CAS-PLEIADES-CARTE-MERE_Pxx_IO_SENSOR.SchDoc
size Tabloid; SheetNumber: 14; SheetTotal: 18; Sheet_Name: BTN, LED, TEMP SENSOR; Size: 11x17
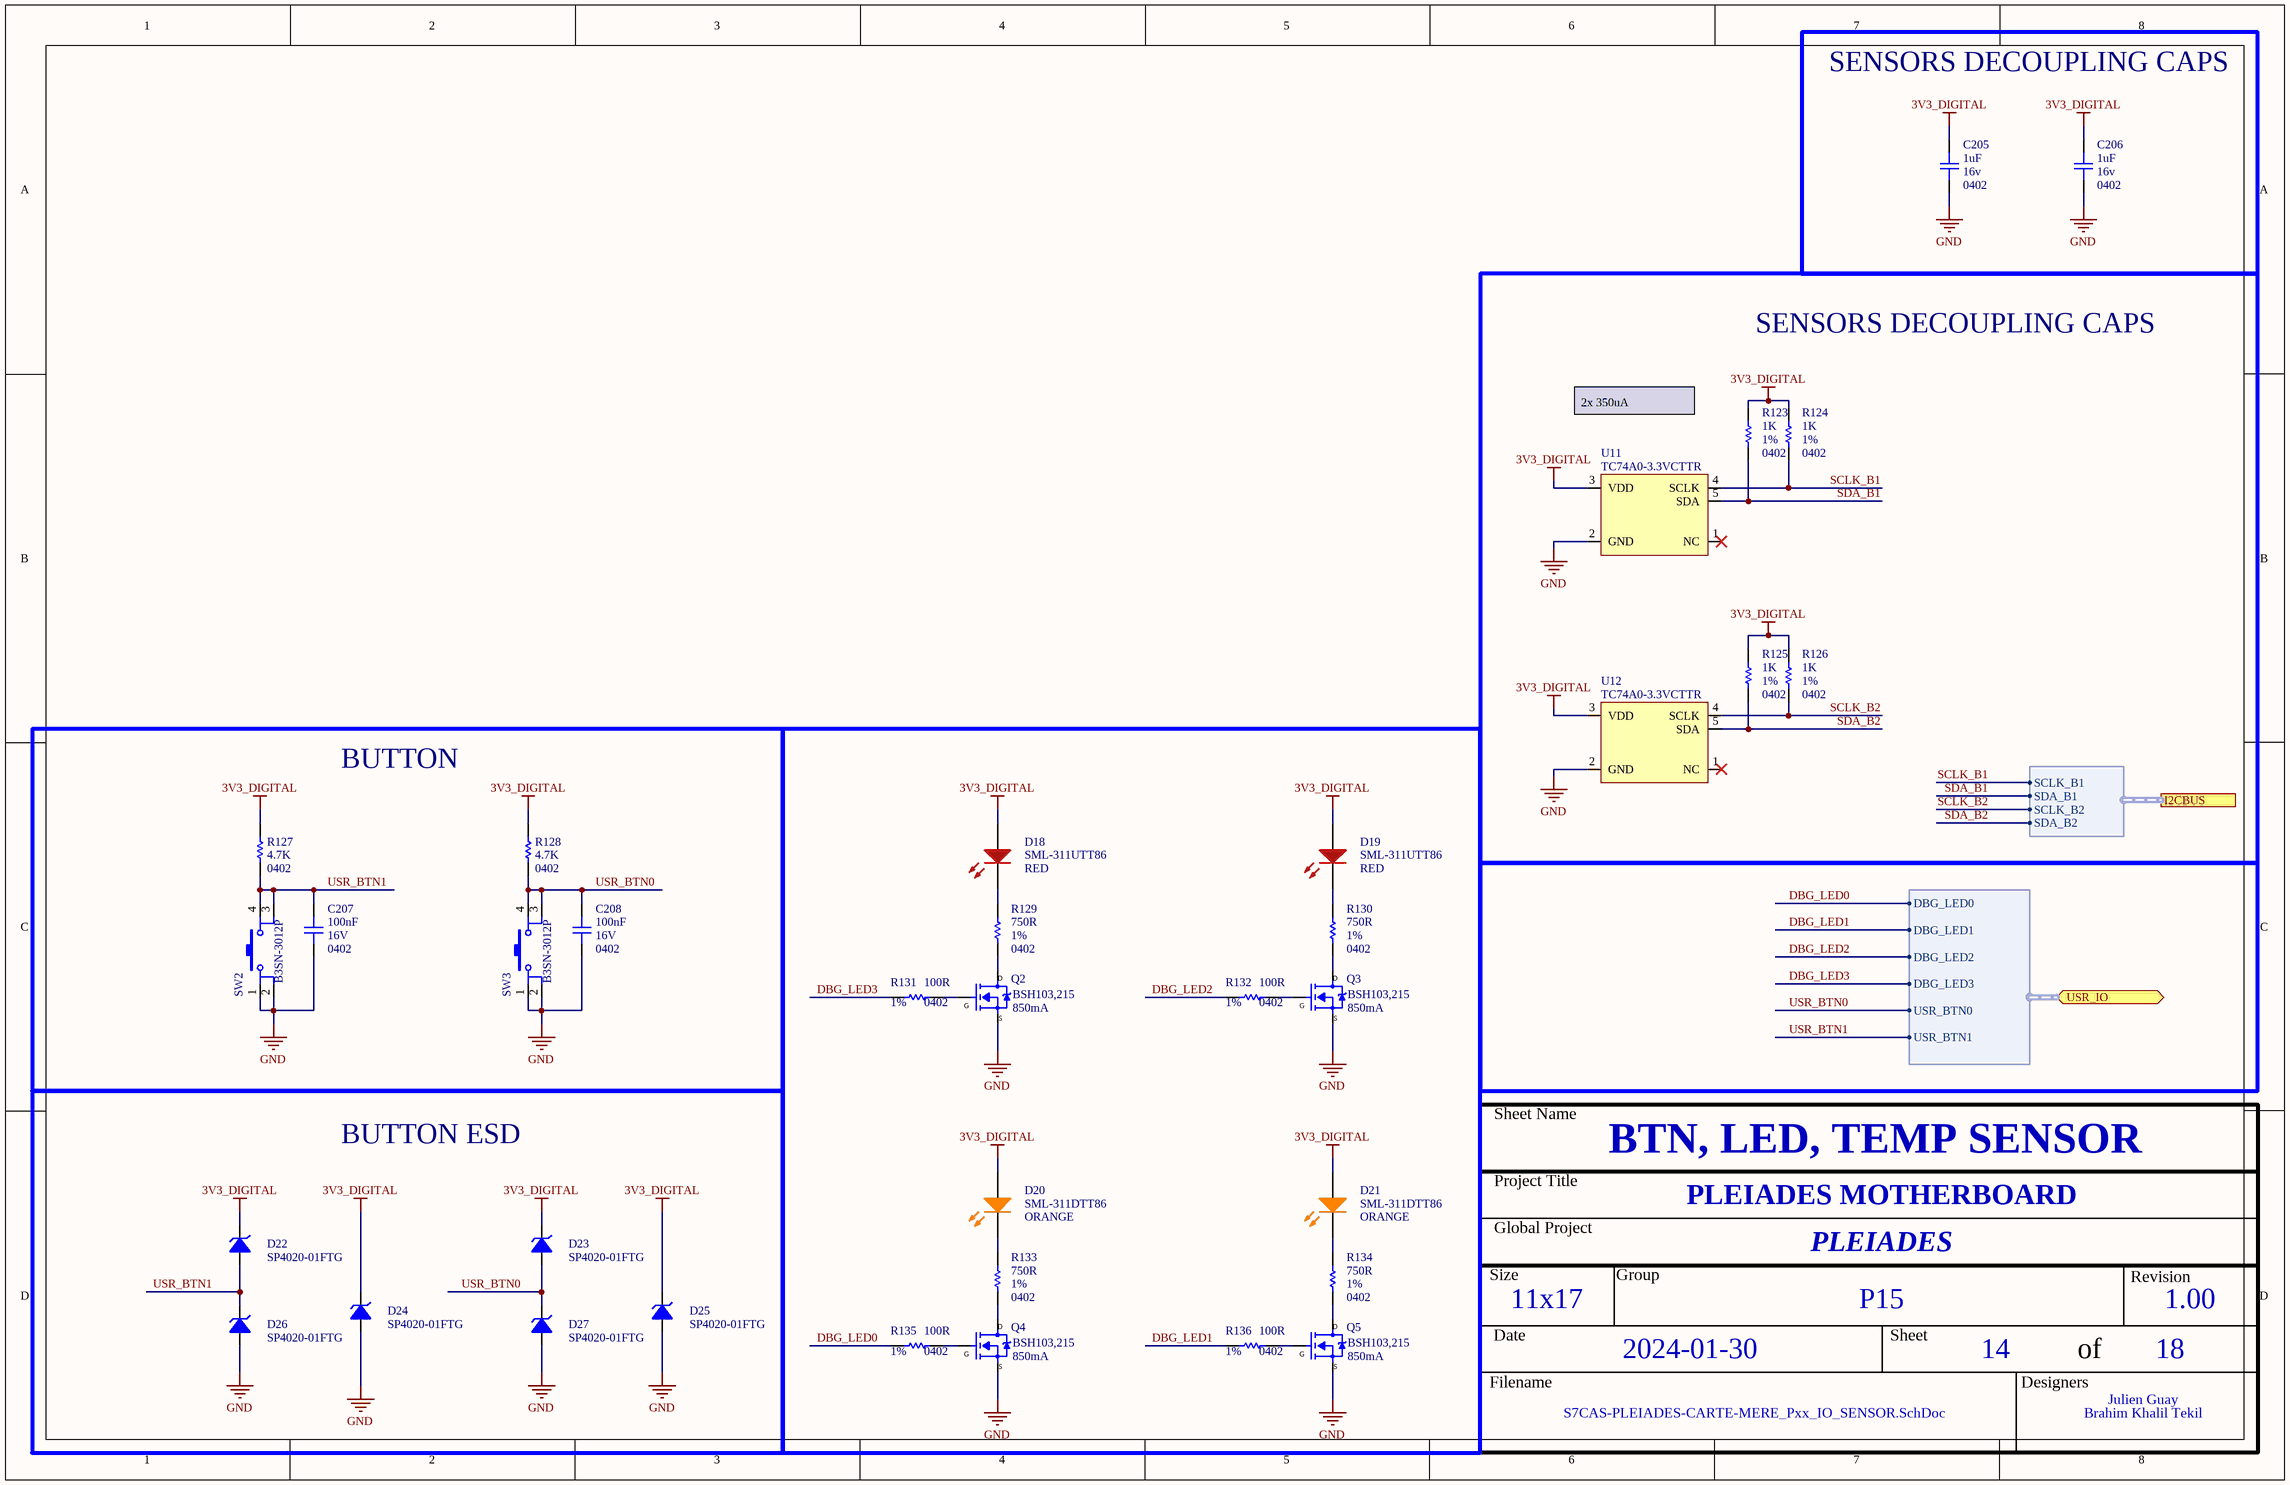
[diagram p9: S7CAS-PLEIADES-CARTE-MERE_Pxx_IO_SENSOR.SchDoc]

### Parts
C205  value 1uF  Voltage: 16v  [CAP_0402]  (hidden comment: 0402)
C206  value 1uF  Voltage: 16v  [CAP_0402]  (hidden comment: 0402)
C207  value 100nF  Voltage: 16V  [CAP_0402]  (hidden comment: 0402)
C208  value 100nF  Voltage: 16V  [CAP_0402]  (hidden comment: 0402)
D18  SML-311UTT86  value RED  [LED_0603]
D19  SML-311UTT86  value RED  [LED_0603]
D20  SML-311DTT86  value ORANGE  [LED_0603]
D21  SML-311DTT86  value ORANGE  [LED_0603]
D22  SP4020-01FTG  [SOD323 - UNIDIR]
D23  SP4020-01FTG  [SOD323 - UNIDIR]
D24  SP4020-01FTG  [SOD323 - UNIDIR]
D25  SP4020-01FTG  [SOD323 - UNIDIR]
D26  SP4020-01FTG  [SOD323 - UNIDIR]
D27  SP4020-01FTG  [SOD323 - UNIDIR]
Q2  BSH103,215  Current: 850mA  [SOT23-3]
Q3  BSH103,215  Current: 850mA  [SOT23-3]
Q4  BSH103,215  Current: 850mA  [SOT23-3]
Q5  BSH103,215  Current: 850mA  [SOT23-3]
R123  value 1K  Package: 0402  Precision: 1%  [RES_0402]  (hidden comment: RES - 0603)
R124  value 1K  Package: 0402  Precision: 1%  [RES_0402]  (hidden comment: RES - 0603)
R125  value 1K  Package: 0402  Precision: 1%  [RES_0402]  (hidden comment: RES - 0603)
R126  value 1K  Package: 0402  Precision: 1%  [RES_0402]  (hidden comment: RES - 0603)
R127  value 4.7K  Package: 0402  [RES_0402]  (hidden comment: RES - 0603)
R128  value 4.7K  Package: 0402  [RES_0402]  (hidden comment: RES - 0603)
R129  value 750R  Package: 0402  Precision: 1%  [RES_0402]  (hidden comment: RES - 0603)
R130  value 750R  Package: 0402  Precision: 1%  [RES_0402]  (hidden comment: RES - 0603)
R131  value 100R  Package: 0402  Precision: 1%  [RES_0402]  (hidden comment: RES - 0603)
R132  value 100R  Package: 0402  Precision: 1%  [RES_0402]  (hidden comment: RES - 0603)
R133  value 750R  Package: 0402  Precision: 1%  [RES_0402]  (hidden comment: RES - 0603)
R134  value 750R  Package: 0402  Precision: 1%  [RES_0402]  (hidden comment: RES - 0603)
R135  value 100R  Package: 0402  Precision: 1%  [RES_0402]  (hidden comment: RES - 0603)
R136  value 100R  Package: 0402  Precision: 1%  [RES_0402]  (hidden comment: RES - 0603)
SW2  B3SN-3012P  [SWI_TACT_B3SN-3012P]
SW3  B3SN-3012P  [SWI_TACT_B3SN-3012P]
U11  TC74A0-3.3VCTTR  [SEN_TEMP_TC74A0-3.3VCTTR]
U12  TC74A0-3.3VCTTR  [SEN_TEMP_TC74A0-3.3VCTTR]

### Blocks framed on the sheet
SENSORS DECOUPLING CAPS: C205 C206
SENSORS DECOUPLING CAPS: R123-R126 U11 U12
BUTTON: C207 C208 R127 R128 SW2 SW3
BUTTON ESD: D22-D27

### Ports
I2CBUS (harness Harness, see S7CAS-PLEIADES-CARTE-MERE_Pxx_FPGA_bank3[5C]), USR_IO (bidir, harness USER_IOS_HARNESS, see S7CAS-PLEIADES-CARTE-MERE_Pxx_FPGA_bank3[5C])

### Harnesses
USER_IOS_HARNESS: DBG_LED0, DBG_LED1, DBG_LED2, DBG_LED3, USR_BTN0, USR_BTN1
Harness: SCLK_B1, SDA_B1, SCLK_B2, SDA_B2

### Nets
3V3_DIGITAL: C205.2 C206.2 D18.A D19.A D20.A D21.A D22.1 D23.1 D24.1 D25.1 R123.2 R124.2 R125.2 R126.2 R127.2 R128.2 U11.3(VDD) U12.3(VDD)
GND: C205.1 C206.1 C207.1 C208.1 D24.2 D25.2 D26.2 D27.2 Q2.2 Q3.2 Q4.2 Q5.2 SW2.1 SW2.2 SW3.1 SW3.2 U11.2(GND) U12.2(GND)
DBG_LED0: R135.2 ; port USR_IO.DBG_LED0
DBG_LED1: R136.2 ; port USR_IO.DBG_LED1
DBG_LED2: R132.2 ; port USR_IO.DBG_LED2
DBG_LED3: R131.2 ; port USR_IO.DBG_LED3
SCLK_B1: R124.1 U11.4(SCLK) ; port I2CBUS.SCLK_B1
SCLK_B2: R126.1 U12.4(SCLK) ; port I2CBUS.SCLK_B2
SDA_B1: R123.1 U11.5(SDA) ; port I2CBUS.SDA_B1
SDA_B2: R125.1 U12.5(SDA) ; port I2CBUS.SDA_B2
USR_BTN0: C208.2 D23.2 D27.1 R128.1 SW3.3 SW3.4 ; port USR_IO.USR_BTN0
USR_BTN1: C207.2 D22.2 D26.1 R127.1 SW2.3 SW2.4 ; port USR_IO.USR_BTN1
NetD18_K: D18.K R129.2
NetD19_K: D19.K R130.2
NetD20_K: D20.K R133.2
NetD21_K: D21.K R134.2
NetQ2_1: Q2.1 R131.1
NetQ2_3: Q2.3 R129.1
NetQ3_1: Q3.1 R132.1
NetQ3_3: Q3.3 R130.1
NetQ4_1: Q4.1 R135.1
NetQ4_3: Q4.3 R133.1
NetQ5_1: Q5.1 R136.1
NetQ5_3: Q5.3 R134.1

Not connected (* = marked no-connect by the designer): U11 1(NC)*; U12 1(NC)*

### Notes on the sheet
- 2x 350uA
- Sheet Name
- Project Title
- Global Project
- Size
- Group
- Revision
- Date
- Sheet
- of
- Filename
- Designers
- (in symbol MOS_N_CHANNEL) D; G; S

### Library data of the parts
C205-C208 = CAP - 0603: CAP - 0402; Precision: 10%; Current: *; CreatedBy: Jonathan Bouchard; Power: *; Package: 0402; Supplier 1: Arrow Electronics
  C205 C206: Supplier Part Number 1: CL10B105MO8NNWC
  C207 C208: Supplier Part Number 1: CL10B104KO8NNNC
D18 D19 = LED_SML-311UTT86: LED - 620nM RED 2mA - 0603; Voltage: 1.8V; Mfg: ROHM Semiconductor; Power: 44mW; Current: 2mA; HelpURL: http://media.digikey.com/pdf/Data%20Sheets/Rohm%20PDFs/SML-311%20Series.pdf; CreatedBy: Jonathan Bouchard; Temperature: -30°C to 85°C; Package: 0603; Precision: *; Mfg Part Number: SML-311UTT86; Supplier 1: Digikey; Supplier Part Number 1: 511-1304-1-ND
D20 D21 = LED_SML-311DTT86: LED - 611nM ORANGE 2mA - 0603; Voltage: 1.8V; Mfg: ROHM Semiconductor; Power: 44mW; Current: 2mA; HelpURL: http://media.digikey.com/pdf/Data%20Sheets/Rohm%20PDFs/SML-311%20Series.pdf; CreatedBy: Jonathan Bouchard; Temperature: -40°C to 85°C; Package: 0603; Precision: *; Mfg Part Number: SML-311DTT86; Supplier 1: Digikey; Supplier Part Number 1: 511-1303-1-ND
D22-D27 = TVS_SP4020-01FTG: TVS - 3.3VWM 21.8V (Typ) Clamp 30A (8/20µs) Ipp Tvs Diode Surface Mount SOD-323; GRAMS Lib Spec: 2.7; Supplier 1: Future Electronics; Supplier Part Number 1: 6058247
Q2-Q5 = MOS_N_CHANNEL: N-Channel  Enhancement Mode Field Effect Transistor; Mfr: *; Package / Case: *; Vds: *; Rds ON: *; Vgs: *; Operating Temperature: *; Supplier 1: Avnet; Supplier Part Number 1: BSH103,215
R123-R126 R129-R136 = RES - 0603: RES - 0402; Current: *; CreatedBy: Jonathan Bouchard
  R129 R130 R133 R134: Supplier 1: Arrow Electronics; Supplier Part Number 1: RMCF0603FT750R
  R131 R132 R135 R136: Supplier 1: Arrow Electronics; Supplier Part Number 1: RMCF0603FT100R
R127 R128 = RES - 0603: RES - 0402; Precision: 1%; Current: *; CreatedBy: Jonathan Bouchard; Supplier 1: Arrow Electronics; Supplier Part Number 1: RMCF0603FT4K70
SW2 SW3 = SWI_TACT_B3SN-3012P: SWI - TACT SPST-NO 0.05A 24V - 4-SMD; Current: 50mA; Mfg: Omron; Mfg Part Number: B3SN-3012P; HelpURL: http://www.omron.com/ecb/products/pdf/en-b3sn.pdf; CreatedBy: Jonathan Bouchard; Temperature: -25°C ~ 70°C; Power: *; Precision: *; Package: 4-SMD; Value: *; Voltage: 24V; Supplier 1: Digikey; Supplier Part Number 1: SW261CT-ND
U11 U12 = SENS_TEMP_TC74A0-3.3VCTTR: SENS - TEMPERATURE SENSOR I2C/SMBUS - SOT23-5; Voltage: 2.7 V ~ 5.5 V; Mfg: Microchip; Precision: ±2°C (±3°C); Current: *; Power: *; Mfg Part Number: TC74A0-3.3VCTTR; HelpURL: http://ww1.microchip.com/downloads/en/DeviceDoc/21462D.pdf; CreatedBy: Jonathan Bouchard; Temperature: -40°C ~ 125°C; Value: *; Package: SOT23-5; Supplier 1: Digikey; Supplier Part Number 1: TC74A0-3.3VCTDKR-ND

## Sheet S7CAS-PLEIADES-CARTE-MERE_Pxx_ARBRE_CAP_ARBRE.SchDoc
size Tabloid; SheetNumber: 16; SheetTotal: 18; Sheet_Name: POWER TREE DECOUPLING; Size: 11x17
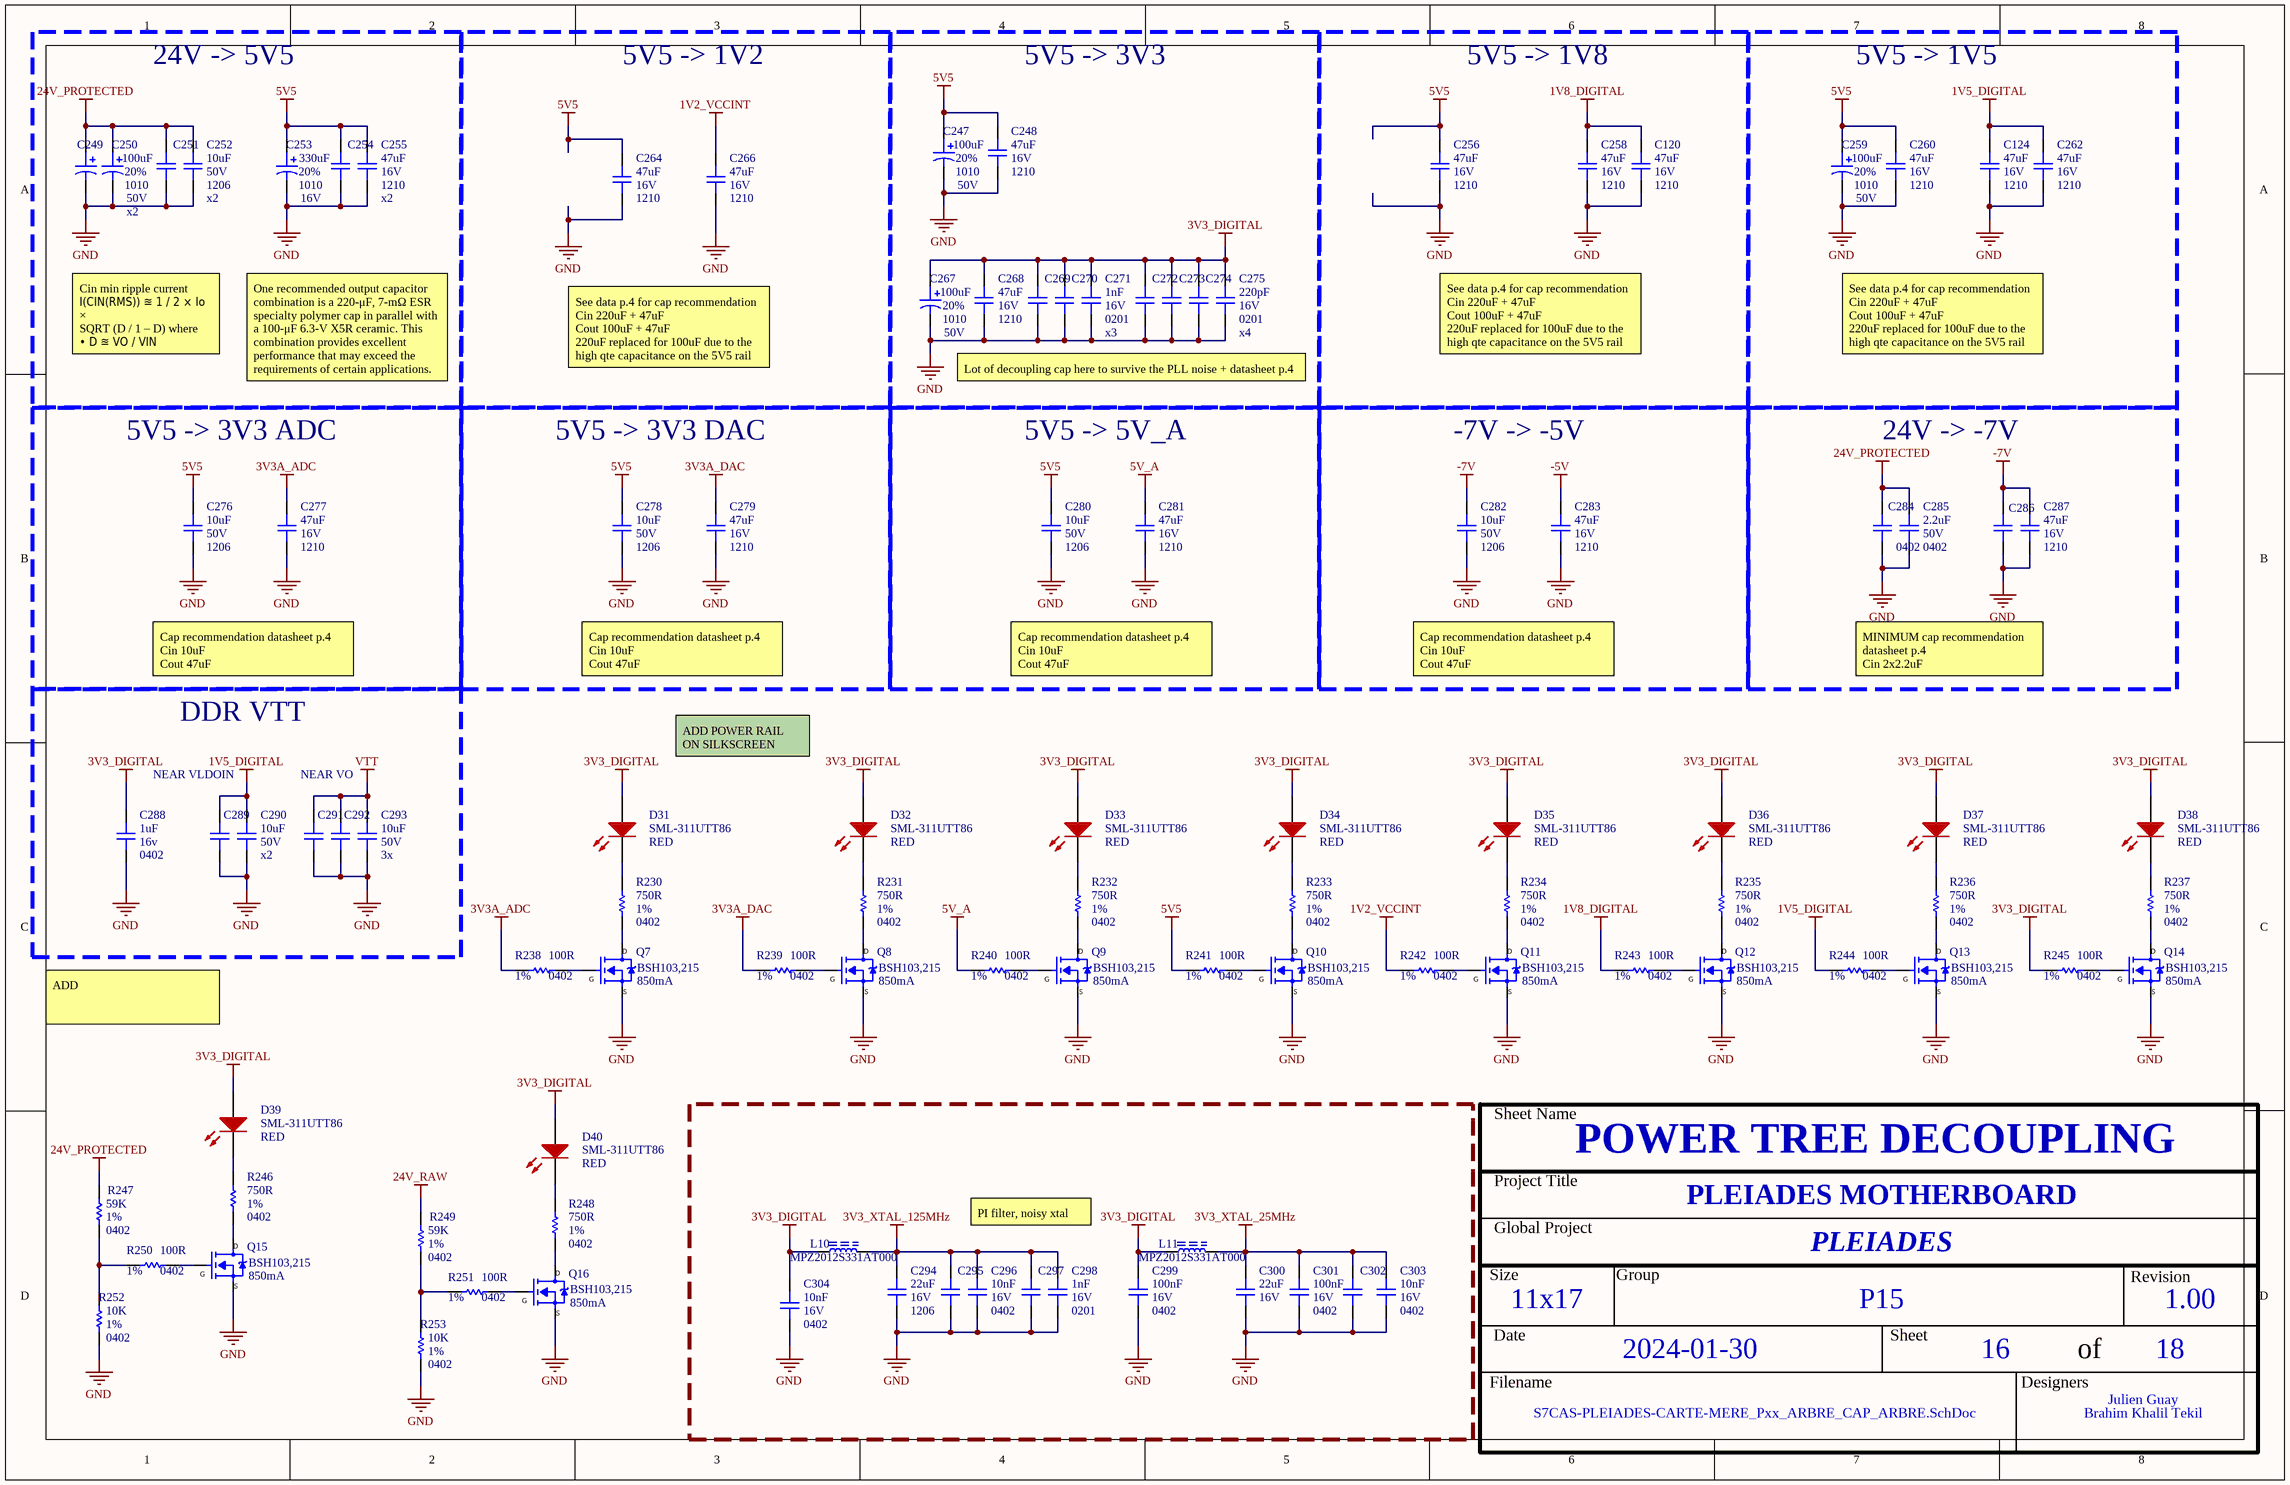
[diagram p10: S7CAS-PLEIADES-CARTE-MERE_Pxx_ARBRE_CAP_ARBRE.SchDoc]

### Parts
C120  value 47uF  Voltage: 16V  Package: 1210  [CAP_1210]  (hidden comment: CAP - 1210)
C124  value 47uF  Voltage: 16V  Package: 1210  [CAP_1210]  (hidden comment: CAP - 1210)
C247  value 100uF  Voltage: 50V  Package: 1010  Precision: 20%  [CAP_ALU_1010_vishay]  (hidden comment: MAL215099101E3)
C248  value 47uF  Voltage: 16V  Package: 1210  [CAP_1210]  (hidden comment: CAP - 1210)
C249  MAL215099101E3  [CAP_ALU_1010_vishay]  (value not drawn)
C250  value 100uF  Voltage: 50V  Package: 1010  Precision: 20%  [CAP_ALU_1010_vishay]  (hidden comment: MAL215099101E3)
C251  CAP - 1206  [CAP_1206]  (value not drawn)
C252  value 10uF  Voltage: 50V  Package: 1206  [CAP_1206]  (hidden comment: CAP - 1206)
C253  value 330uF  Voltage: 16V  Package: 1010  Precision: 20%  [CAP_ALU_1010_vishay]  (hidden comment: MAL214699501E3)
C254  CAP - 1210  [CAP_1210]  (value not drawn)
C255  value 47uF  Voltage: 16V  Package: 1210  [CAP_1210]  (hidden comment: CAP - 1210)
C256  value 47uF  Voltage: 16V  Package: 1210  [CAP_1210]  (hidden comment: CAP - 1210)
C258  value 47uF  Voltage: 16V  Package: 1210  [CAP_1210]  (hidden comment: CAP - 1210)
C259  value 100uF  Voltage: 50V  Package: 1010  Precision: 20%  [CAP_ALU_1010_vishay]  (hidden comment: MAL215099101E3)
C260  value 47uF  Voltage: 16V  Package: 1210  [CAP_1210]  (hidden comment: CAP - 1210)
C262  value 47uF  Voltage: 16V  Package: 1210  [CAP_1210]  (hidden comment: CAP - 1210)
C264  value 47uF  Voltage: 16V  Package: 1210  [CAP_1210]  (hidden comment: CAP - 1210)
C266  value 47uF  Voltage: 16V  Package: 1210  [CAP_1210]  (hidden comment: CAP - 1210)
C267  value 100uF  Voltage: 50V  Package: 1010  Precision: 20%  [CAP_ALU_1010_vishay]  (hidden comment: MAL215099101E3)
C268  value 47uF  Voltage: 16V  Package: 1210  [CAP_1210]  (hidden comment: CAP - 1210)
C269  CAP - 0201  [CAP_0201]  (value not drawn)
C270  CAP - 0201  [CAP_0201]  (value not drawn)
C271  value 1nF  Voltage: 16V  Package: 0201  [CAP_0201]  (hidden comment: CAP - 0201)
C272  CAP - 0201  [CAP_0201]  (value not drawn)
C273  CAP - 0201  [CAP_0201]  (value not drawn)
C274  CAP - 0201  [CAP_0201]  (value not drawn)
C275  value 220pF  Voltage: 16V  Package: 0201  [CAP_0201]  (hidden comment: CAP - 0201)
C276  value 10uF  Voltage: 50V  Package: 1206  [CAP_1206]  (hidden comment: CAP - 1206)
C277  value 47uF  Voltage: 16V  Package: 1210  [CAP_1210]  (hidden comment: CAP - 1210)
C278  value 10uF  Voltage: 50V  Package: 1206  [CAP_1206]  (hidden comment: CAP - 1206)
C279  value 47uF  Voltage: 16V  Package: 1210  [CAP_1210]  (hidden comment: CAP - 1210)
C280  value 10uF  Voltage: 50V  Package: 1206  [CAP_1206]  (hidden comment: CAP - 1206)
C281  value 47uF  Voltage: 16V  Package: 1210  [CAP_1210]  (hidden comment: CAP - 1210)
C282  value 10uF  Voltage: 50V  Package: 1206  [CAP_1206]  (hidden comment: CAP - 1206)
C283  value 47uF  Voltage: 16V  Package: 1210  [CAP_1210]  (hidden comment: CAP - 1210)
C284  Package: 0402  [CAP_0402]  (hidden comment: CAP - 0402)
C285  value 2.2uF  Voltage: 50V  Package: 0402  [CAP_0402]  (hidden comment: CAP - 0402)
C286  CAP - 1210  [CAP_1210]  (value not drawn)
C287  value 47uF  Voltage: 16V  Package: 1210  [CAP_1210]  (hidden comment: CAP - 1210)
C288  value 1uF  Voltage: 16v  Package: 0402  [CAP_0402]  (hidden comment: CAP - 0402)
C289  CAP - 0805  [CAP_0805]  (value not drawn)
C290  value 10uF  Voltage: 50V  [CAP_0805]  (hidden comment: CAP - 0805)
C291  CAP - 0805  [CAP_0805]  (value not drawn)
C292  CAP - 0805  [CAP_0805]  (value not drawn)
C293  value 10uF  Voltage: 50V  [CAP_0805]  (hidden comment: CAP - 0805)
C294  value 22uF  Voltage: 16V  Package: 1206  [CAP_1206]  (hidden comment: CAP - 1206)
C295  CAP - 0402  [CAP_0402]  (value not drawn)
C296  value 10nF  Voltage: 16V  Package: 0402  [CAP_0402]  (hidden comment: CAP - 0402)
C297  CAP - 0201  [CAP_0201]  (value not drawn)
C298  value 1nF  Voltage: 16V  Package: 0201  [CAP_0201]  (hidden comment: CAP - 0201)
C299  value 100nF  Voltage: 16V  Package: 0402  [CAP_0402]  (hidden comment: CAP - 0402)
C300  value 22uF  Voltage: 16V  [CAP_1206]  (hidden comment: CAP - 1206)
C301  value 100nF  Voltage: 16V  Package: 0402  [CAP_0402]  (hidden comment: CAP - 0402)
C302  CAP - 0402  [CAP_0402]  (value not drawn)
C303  value 10nF  Voltage: 16V  Package: 0402  [CAP_0402]  (hidden comment: CAP - 0402)
C304  value 10nF  Voltage: 16V  Package: 0402  [CAP_0402]  (hidden comment: CAP - 0402)
D31  SML-311UTT86  value RED  [LED_0603]
D32  SML-311UTT86  value RED  [LED_0603]
D33  SML-311UTT86  value RED  [LED_0603]
D34  SML-311UTT86  value RED  [LED_0603]
D35  SML-311UTT86  value RED  [LED_0603]
D36  SML-311UTT86  value RED  [LED_0603]
D37  SML-311UTT86  value RED  [LED_0603]
D38  SML-311UTT86  value RED  [LED_0603]
D39  SML-311UTT86  value RED  [LED_0603]
D40  SML-311UTT86  value RED  [LED_0603]
L10  Mfg Part Number: MPZ2012S331AT000  [FER_0805]  (hidden comment: FER - 0805)
L11  Mfg Part Number: MPZ2012S331AT000  [FER_0805]  (hidden comment: FER - 0805)
Q7  BSH103,215  Current: 850mA  [SOT23-3]
Q8  BSH103,215  Current: 850mA  [SOT23-3]
Q9  BSH103,215  Current: 850mA  [SOT23-3]
Q10  BSH103,215  Current: 850mA  [SOT23-3]
Q11  BSH103,215  Current: 850mA  [SOT23-3]
Q12  BSH103,215  Current: 850mA  [SOT23-3]
Q13  BSH103,215  Current: 850mA  [SOT23-3]
Q14  BSH103,215  Current: 850mA  [SOT23-3]
Q15  BSH103,215  Current: 850mA  [SOT23-3]
Q16  BSH103,215  Current: 850mA  [SOT23-3]
R230  value 750R  Package: 0402  Precision: 1%  [RES_0402]  (hidden comment: RES - 0402)
R231  value 750R  Package: 0402  Precision: 1%  [RES_0402]  (hidden comment: RES - 0402)
R232  value 750R  Package: 0402  Precision: 1%  [RES_0402]  (hidden comment: RES - 0402)
R233  value 750R  Package: 0402  Precision: 1%  [RES_0402]  (hidden comment: RES - 0402)
R234  value 750R  Package: 0402  Precision: 1%  [RES_0402]  (hidden comment: RES - 0402)
R235  value 750R  Package: 0402  Precision: 1%  [RES_0402]  (hidden comment: RES - 0402)
R236  value 750R  Package: 0402  Precision: 1%  [RES_0402]  (hidden comment: RES - 0402)
R237  value 750R  Package: 0402  Precision: 1%  [RES_0402]  (hidden comment: RES - 0402)
R238  value 100R  Package: 0402  Precision: 1%  [RES_0402]  (hidden comment: RES - 0402)
R239  value 100R  Package: 0402  Precision: 1%  [RES_0402]  (hidden comment: RES - 0402)
R240  value 100R  Package: 0402  Precision: 1%  [RES_0402]  (hidden comment: RES - 0402)
R241  value 100R  Package: 0402  Precision: 1%  [RES_0402]  (hidden comment: RES - 0402)
R242  value 100R  Package: 0402  Precision: 1%  [RES_0402]  (hidden comment: RES - 0402)
R243  value 100R  Package: 0402  Precision: 1%  [RES_0402]  (hidden comment: RES - 0402)
R244  value 100R  Package: 0402  Precision: 1%  [RES_0402]  (hidden comment: RES - 0402)
R245  value 100R  Package: 0402  Precision: 1%  [RES_0402]  (hidden comment: RES - 0402)
R246  value 750R  Package: 0402  Precision: 1%  [RES_0402]  (hidden comment: RES - 0402)
R247  value 59K  Package: 0402  Precision: 1%  [RES_0402]  (hidden comment: RES - 0402)
R248  value 750R  Package: 0402  Precision: 1%  [RES_0402]  (hidden comment: RES - 0402)
R249  value 59K  Package: 0402  Precision: 1%  [RES_0402]  (hidden comment: RES - 0402)
R250  value 100R  Package: 0402  Precision: 1%  [RES_0402]  (hidden comment: RES - 0402)
R251  value 100R  Package: 0402  Precision: 1%  [RES_0402]  (hidden comment: RES - 0402)
R252  value 10K  Package: 0402  Precision: 1%  [RES_0402]  (hidden comment: RES - 0402)
R253  value 10K  Package: 0402  Precision: 1%  [RES_0402]  (hidden comment: RES - 0402)

### Blocks framed on the sheet
24V -> 5V5: C249-C255
5V5 -> 1V2: C264 C266
5V5 -> 3V3: C247 C248 C267-C275
5V5 -> 1V8: C120 C256 C258
5V5 -> 1V5: C124 C259 C260 C262
5V5 -> 3V3 ADC: C276 C277
5V5 -> 3V3 DAC: C278 C279
5V5 -> 5V_A: C280 C281
-7V -> -5V: C282 C283
24V -> -7V: C284-C287
DDR VTT: C288-C293

### Nets
1V2_VCCINT: C266.2 R242.2
1V5_DIGITAL: C124.2 C262.2 C289.2 C290.2 R244.2
1V8_DIGITAL: C120.2 C258.2 R243.2
3V3_DIGITAL: C267.1 C268.2 C269.2 C270.2 C271.2 C272.2 C273.2 C274.2 C275.2 C288.2 C299.2 C304.2 D31.A D32.A D33.A D34.A D35.A D36.A D37.A D38.A D39.A D40.A L10.2 L11.2 R245.2
3V3_XTAL_25MHz: C300.2 C301.2 C302.2 C303.2 L11.1
3V3_XTAL_125MHz: C294.2 C295.2 C296.2 C297.2 C298.2 L10.1
3V3A_ADC: C277.2 R238.2
3V3A_DAC: C279.2 R239.2
5V5: C247.1 C248.2 C253.1 C254.2 C255.2 C256.2 C259.1 C260.2 C264.2 C276.2 C278.2 C280.2 R241.2
5V_A: C281.2 R240.2
24V_PROTECTED: C249.1 C250.1 C251.2 C252.2 C284.2 C285.2 R247.2
24V_RAW: R249.2
-5V: C283.2
-7V: C282.2 C286.2 C287.2
GND: C120.1 C124.1 C247.2 C248.1 C249.2 C250.2 C251.1 C252.1 C253.2 C254.1 C255.1 C256.1 C258.1 C259.2 C260.1 C262.1 C264.1 C266.1 C267.2 C268.1 C269.1 C270.1 C271.1 C272.1 C273.1 C274.1 C275.1 C276.1 C277.1 C278.1 C279.1 C280.1 C281.1 C282.1 C283.1 C284.1 C285.1 C286.1 C287.1 C288.1 C289.1 C290.1 C291.1 C292.1 C293.1 C294.1 C295.1 C296.1 C297.1 C298.1 C299.1 C300.1 C301.1 C302.1 C303.1 C304.1 Q7.2 Q8.2 Q9.2 Q10.2 Q11.2 Q12.2 Q13.2 Q14.2 Q15.2 Q16.2 R252.1 R253.1
VTT: C291.2 C292.2 C293.2
NetD31_K: D31.K R230.2
NetD32_K: D32.K R231.2
NetD33_K: D33.K R232.2
NetD34_K: D34.K R233.2
NetD35_K: D35.K R234.2
NetD36_K: D36.K R235.2
NetD37_K: D37.K R236.2
NetD38_K: D38.K R237.2
NetD39_K: D39.K R246.2
NetD40_K: D40.K R248.2
NetQ7_1: Q7.1 R238.1
NetQ7_3: Q7.3 R230.1
NetQ8_1: Q8.1 R239.1
NetQ8_3: Q8.3 R231.1
NetQ9_1: Q9.1 R240.1
NetQ9_3: Q9.3 R232.1
NetQ10_1: Q10.1 R241.1
NetQ10_3: Q10.3 R233.1
NetQ11_1: Q11.1 R242.1
NetQ11_3: Q11.3 R234.1
NetQ12_1: Q12.1 R243.1
NetQ12_3: Q12.3 R235.1
NetQ13_1: Q13.1 R244.1
NetQ13_3: Q13.3 R236.1
NetQ14_1: Q14.1 R245.1
NetQ14_3: Q14.3 R237.1
NetQ15_1: Q15.1 R250.1
NetQ15_3: Q15.3 R246.1
NetQ16_1: Q16.1 R251.1
NetQ16_3: Q16.3 R248.1
NetR247_1: R247.1 R250.2 R252.2
NetR249_1: R249.1 R251.2 R253.2

### Notes on the sheet
- x2
- (near C252) x2
- (near C255) x2
- Cin min ripple current
  I(CIN(RMS)) ≊ 1 / 2 × Io ×
  SQRT (D / 1 – D) where
  • D ≊ VO / VIN
  Iripple = 0.55A
- See data p.4 for cap recommendation
  Cin 220uF + 47uF
  Cout 100uF + 47uF
  220uF replaced for 100uF due to the high qte capacitance on the 5V5 rail
- x3
- (near C275) x4
- One recommended output capacitor combination is a 220-μF, 7-mΩ ESR specialty polymer cap in parallel with a 100-μF 6.3-V X5R ceramic. This combination provides excellent performance that may exceed the requirements of certain applications.
- Lot of decoupling cap here to survive the PLL noise + datasheet p.4
- Cap recommendation datasheet p.4
  Cin 10uF
  Cout 47uF
- MINIMUM cap recommendation datasheet p.4
  Cin 2x2.2uF
  Cout 2x47uF
- ADD POWER RAIL
  ON SILKSCREEN
- NEAR VLDOIN
- NEAR VO
- (near C290) x2
- (near C293) 3x
- ADD
- PI filter, noisy xtal
- Sheet Name
- Project Title
- Global Project
- Size
- Group
- Revision
- Date
- Sheet
- of
- Filename
- Designers
- (in symbol MOS_N_CHANNEL) D; G; S

### Library data of the parts
C120 C124 C248 C255 C256 C258 C260 C262 C264 C266 C268 C277 C279 C281 C283 C287 = CAP - 1210: Precision: 10%; Current: *; CreatedBy: Jonathan Bouchard; Power: *; Supplier 1: Arrow Electronics; Supplier Part Number 1: CL32A476KOJNNNE
C247 C249 C250 C259 C267 = CAP_ALU_MAL215099101E3: CAP - ALU 100uF 20% 50V - 1010; Current: 490mA; Mfg: Vishay Dale; Mfg Part Number: MAL215099101E3; HelpURL: http://www.vishay.com/docs/28395/150crz.pdf; CreatedBy: Jonathan Bouchard; Temperature: -55°C to 125°C; Power: *; Supplier 1: Digikey; Supplier Part Number 1: 4399PHDKR-ND
C251 = CAP - 1206: Precision: 10%; Voltage: 50V; Value: 10uF; Current: *; CreatedBy: Jonathan Bouchard; Power: *; Package: 1206; Supplier 1: Avnet; Supplier Part Number 1: CL31A106MBHNNNE
C252 C276 C278 C280 C282 C294 C300 = CAP - 1206: Precision: 10%; Current: *; CreatedBy: Jonathan Bouchard; Power: *
  C252 C276 C278 C280 C282: Supplier 1: Avnet; Supplier Part Number 1: CL31A106MBHNNNE
  C294: Supplier 1: Arrow Electronics; Supplier Part Number 1: CL31A226MOCLNNC
  C300: Package: 1206; Supplier 1: Arrow Electronics; Supplier Part Number 1: CL31A226MOCLNNC
C253 = CAP_ALU_MAL214699501E3: CAP - ALU 330uF 20% 16V - 1010; Current: 750mA; Mfg: Vishay Dale; Mfg Part Number: MAL214699501E3; HelpURL: http://www.vishay.com/docs/28403/146cti.pdf; CreatedBy: Jonathan Bouchard; Temperature: -55°C to 125°C; Power: *; Supplier 1: Digikey; Supplier Part Number 1: 4405PHCT-ND
C254 C286 = CAP - 1210: Precision: 10%; Voltage: 16V; Value: 47uF; Current: *; CreatedBy: Jonathan Bouchard; Power: *; Package: 1210; Supplier 1: Arrow Electronics; Supplier Part Number 1: CL32A476KOJNNNE
C269 C270 C297 = CAP - 0201: Precision: 10%; Voltage: 16V; Value: 1nF; Current: *; CreatedBy: Jonathan Bouchard; Power: *; Package: 0201; Supplier 1: Avnet; Supplier Part Number 1: GRM033R71C102KA01J
C271 C275 C298 = CAP - 0201: Precision: 10%; Current: *; CreatedBy: Jonathan Bouchard; Power: *
  C271 C298: Supplier 1: Avnet; Supplier Part Number 1: GRM033R71C102KA01J
  C275: Supplier 1: Arrow Electronics; Supplier Part Number 1: GRM033R71C221KA01D
C272-C274 = CAP - 0201: as C170-C172 on sheet S7CAS-PLEIADES-CARTE-MERE_Pxx_CAN; Current: *; CreatedBy: Jonathan Bouchard; Power: *; Package: 0201; Supplier 1: Arrow Electronics; Supplier Part Number 1: GRM033R71C221KA01D
C284 = CAP - 0603: Precision: 10%; Voltage: 50V; Value: 2.2uF; Current: *; CreatedBy: Jonathan Bouchard; Power: *; Supplier 1: Arrow Electronics; Supplier Part Number 1: GRM188R61H225KE11D
C285 C288 C299 C301 = CAP - 0603: Precision: 10%; Current: *; CreatedBy: Jonathan Bouchard; Power: *; Supplier 1: Arrow Electronics
  C285: Supplier Part Number 1: GRM188R61H225KE11D
  C288: Supplier Part Number 1: CL10B105MO8NNWC
  C299 C301: Supplier Part Number 1: CL10B104KO8NNNC
C289 C291 C292 = CAP - 0805: Precision: 10%; Voltage: 50V; Value: 10uF; Current: *; CreatedBy: Jonathan Bouchard; Power: *; Package: 0805; Supplier 1: Avnet; Supplier Part Number 1: CL31A106MBHNNNE
C290 C293 = CAP - 0805: Precision: 10%; Current: *; CreatedBy: Jonathan Bouchard; Power: *; Package: 0805; Supplier 1: Avnet; Supplier Part Number 1: CL31A106MBHNNNE
C295 C302 = CAP - 0402: as C161 on sheet S7CAS-PLEIADES-CARTE-MERE_Pxx_CAN; Current: *; CreatedBy: Jonathan Bouchard; Power: *; Package: 0402; Supplier 1: Arrow Electronics; Supplier Part Number 1: GRM155R61A224KE19D
C296 C303 C304 = CAP - 0402: Precision: 10%; Current: *; CreatedBy: Jonathan Bouchard; Power: *; Supplier 1: Arrow Electronics; Supplier Part Number 1: GRM155R61A224KE19D
D31-D40 = LED_SML-311UTT86: as D18 on sheet S7CAS-PLEIADES-CARTE-MERE_Pxx_IO_SENSOR; Current: 2mA; HelpURL: http://media.digikey.com/pdf/Data%20Sheets/Rohm%20PDFs/SML-311%20Series.pdf; CreatedBy: Jonathan Bouchard; Temperature: -30°C to 85°C; Package: 0603; Precision: *; Mfg Part Number: SML-311UTT86; Supplier 1: Digikey; Supplier Part Number 1: 511-1304-1-ND
L10 L11 = FER - 0805: Mfg: TDK Corporation; Current: 2.5A; Value: 50mR@0Hz / 330R@100MHz; Voltage: *; CreatedBy: Jonathan Bouchard; Power: *; Precision: *; Package: 0805; Supplier 1: Arrow Electronics; Supplier Part Number 1: MPZ2012S331AT000
Q7-Q16 = MOS_N_CHANNEL: as Q2 on sheet S7CAS-PLEIADES-CARTE-MERE_Pxx_IO_SENSOR; Mfr: *; Package / Case: *; Vds: *; Rds ON: *; Vgs: *; Operating Temperature: *; Supplier 1: Avnet; Supplier Part Number 1: BSH103,215
R230-R253 = RES - 0603: Current: *; CreatedBy: Jonathan Bouchard; Supplier 1: Arrow Electronics
  R230-R237 R246 R248: Supplier Part Number 1: RMCF0603FT750R
  R238-R245 R250 R251: Supplier Part Number 1: RMCF0603FT100R
  R247 R249: Supplier Part Number 1: RMCF0603FT59K0
  R252 R253: Supplier Part Number 1: RMCF0603FT10K0